# EasyEDA Pro project ProProject_李勇成毕设2_2024-03-25_23-08-12_2024-03-26.epro

# Schematic Schematic1
Create Date: 2024-03-25; Page Name: P1; Project Name: 李勇成毕设_2024-03-25_23-08-12; Schematic Name: Schematic1; Update Date: 2024-03-25; Company: 嘉立创EDA; Page Size: A4; Version: V1.0
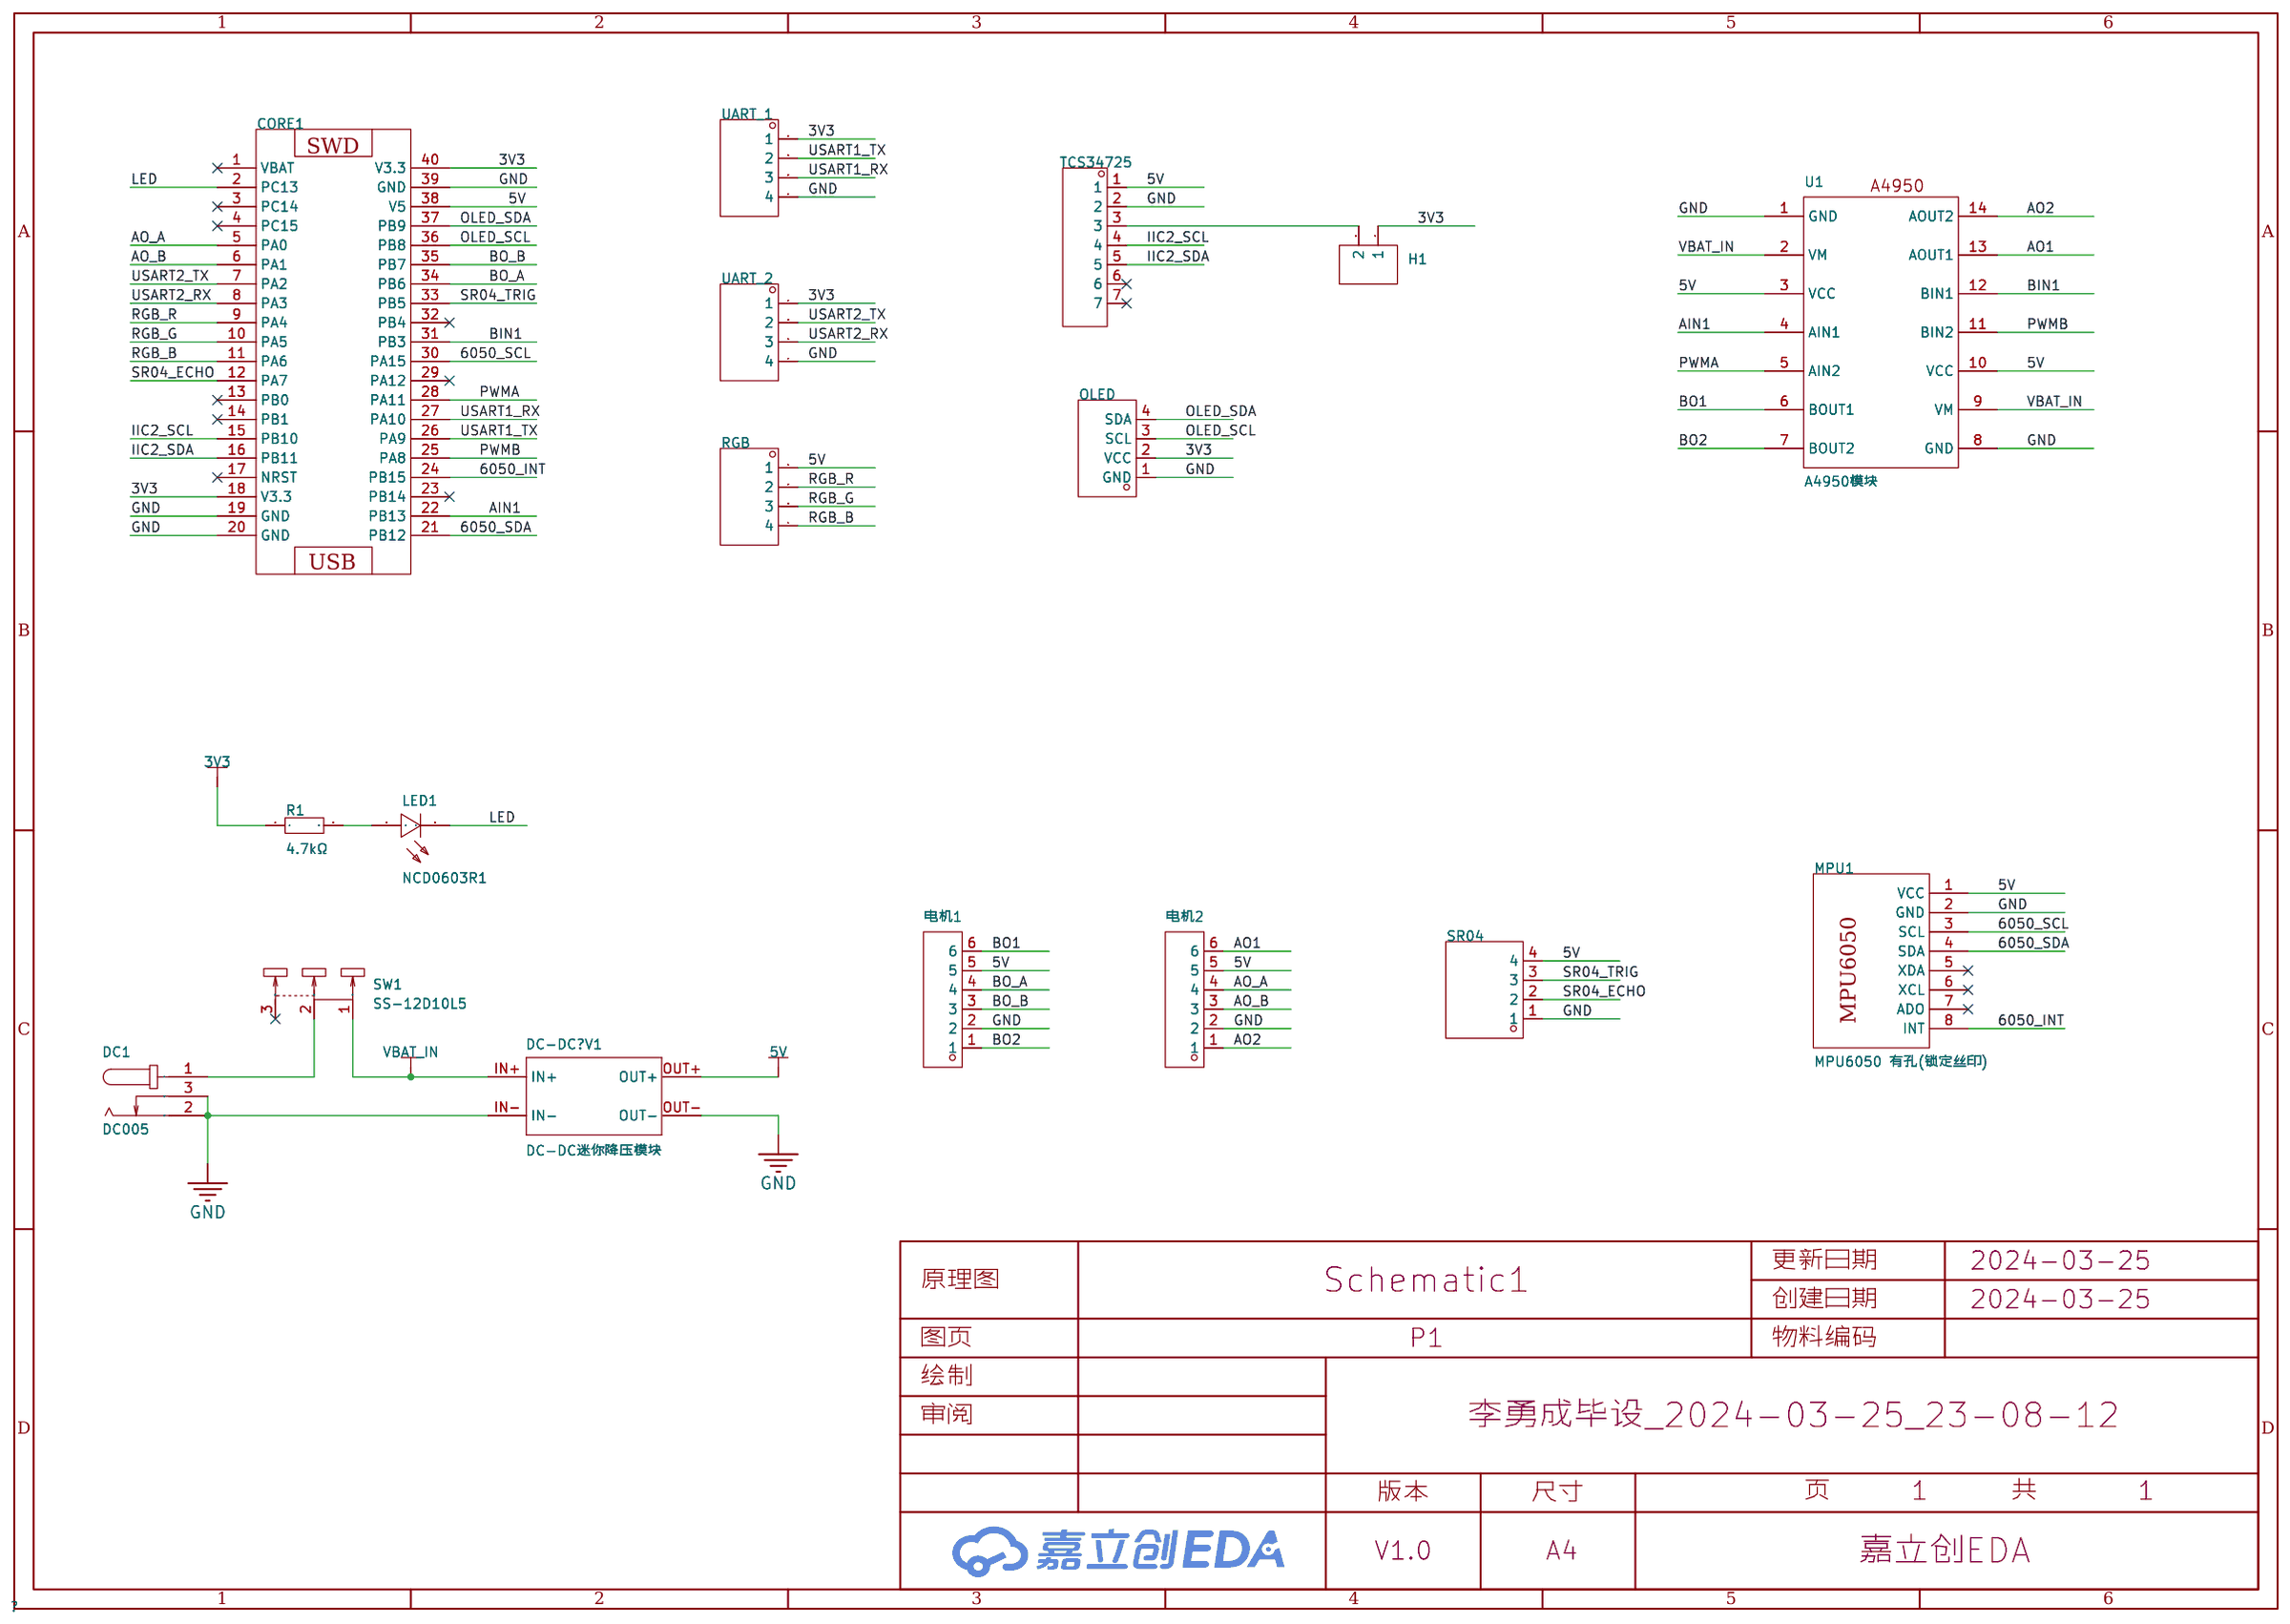
[diagram p0: schematic sheet]

## Parts
CORE1  -  [STM32F103C8T6核心板]
DC1  DC005  [DC-IN-TH_DC005]
DC-DC?V1  DC-DC迷你降压模块  [DC-DC迷你降压模块]
H1  -  [HDR-TH_2P-P2.54-V-F]
LED1  NCD0603R1  [LED0603-RD_RED]
MPU1  MPU6050 有孔(锁定丝印)  [MPU6050-丝印不可移]
OLED  HS96L03W2C03  [OLED-TH_L27.8-W27.2-P2.54_C9900033791]
R1  4.7kΩ  [R0603]
RGB  RGB  [HDR-TH_4P-P2.54-V-M]
SR04  A2541HWV-4P  [HDR-TH_4P-P2.54-V_A2541HWV-4P]
SW1  SS-12D10L5  [SW-TH_SS-12D10L5]
TCS34725  TCS34725  [HDR-TH_7P-P2.54-V-F]
U1  A4950模块  [A4950]
UART_1  UART_1  [HDR-TH_4P-P2.54-V-M]
UART_2  UART_2  [HDR-TH_4P-P2.54-V-M]
电机1  X8821WR-06S-N0SN  [CONN-TH_6P-P2.50_X8821WR-06S-N2SN]
电机2  X8821WR-06S-N0SN  [CONN-TH_6P-P2.50_X8821WR-06S-N2SN]

## Library data of the parts
CORE1 = STM32F103C8T6核心板: tags: STM32; Supplier Part: C8734; Manufacturer: 无; Manufacturer Part: STM32F103C8T6最小系统模块; image: http://image.lceda.cn/szlcsc/C8734.jpg
DC1 = DC005: 连接器类型:DC电源插座;安装方式:弯插;触点内径:2mm;触点外径:6.3mm;额定电流:500mA;额定电压:30V;工作温度范围:-40℃~+55℃;; LCSC Part Name: DC电源插座 内径:2mm 外径:6.3mm; Supplier Part: C431533; Manufacturer: SHOU HAN(首韩); Supplier Footprint: 插件; JLCPCB Part Class: 扩展库; Datasheet: https://atta.szlcsc.com/upload/public/pdf/source/20190925/C431533_4751811035784AC1D38EBC85F7905E99.pdf; Supplier: LCSC; Connector Type: DC电源插座; Mounting Style: 弯插; Inside Contact Diameter: 2mm; Outside Contact Diameter: 6.3mm; Current Rating (Max): 500mA; Voltage Rating (Max): 30V; Operating Temperature Range: -40℃~+55℃
DC-DC?V1 = DC-DC迷你降压模块: _: 3
H1 = HDR-F_2.54_1x2P: Supplier Part: C49661; Supplier Footprint: 插件
LED1 = NCD0603R1_C84263: 灯头类型:-;发光颜色:红色;正向电压(VF):1.6V~2.6V;功率:65mW;正向电流:20mA;主波长:615nm~630nm;二极管配置:独立二极管;透镜颜色:无色透明透镜;色温:-;发光强度:80mcd~220mcd;发光角度:130°;载带方式:-;工作温度:-30℃~+85℃;; Supplier Part: C84263; Manufacturer: 国星光电; Supplier Footprint: 0603; JLCPCB Part Class: 扩展库; Datasheet: https://atta.szlcsc.com/upload/public/pdf/source/20200820/C84263_DABC6A75E58F576973B407FDBA283D60.pdf; Supplier: LCSC; Emitted Color: 红色; Forward Voltage (VF): 1.6V~2.6V; Power Dissipation: 65mW; Forward Current: 20mA; Dominant Wavelength: 615nm~630nm; Diode Configuration: 独立二极管; Lens Color: 无色透明透镜; Luminous Intensity: 80mcd~220mcd; Viewing Angle: 130°; Operating Temperature: -30℃~+85℃
MPU1 = MPU6050 有孔(锁定丝印)
OLED = HS96L03W2C03: 主控芯片:SSD1315;接口类型:I2C;尺寸(inch):0.96;像素分辨率:128x64;; LCSC Part Name: 0.96寸OLED显示屏窄白光IIC; Supplier Part: C5248080; Manufacturer: HS(汉昇); JLCPCB Part Class: Extended Part; Datasheet: https://atta.szlcsc.com/upload/public/pdf/source/20230627/763D01F79A90007632F098068C7C8AD9.pdf; Supplier: LCSC; Main Control Chip: SSD1315; Interface Type: I2C; Size: 0.96; Pixel Resolution: 128x64; Operating Temperature: -40℃~+70℃
R1 = 0603WAF1002T5E: 电阻类型:厚膜电阻;阻值:10kΩ;精度:±1%;功率:100mW;最大工作电压:75V;温度系数:±100ppm/℃;; LCSC Part Name: 厚膜电阻 10kΩ ±1% 100mW; Supplier Part: C25804; Manufacturer: UNI-ROYAL(厚声); Supplier Footprint: 0603; JLCPCB Part Class: Basic Part; Datasheet: https://atta.szlcsc.com/upload/public/pdf/source/20200306/C422600_1E6D84923E4A46A82E41ADD87F860B5C.pdf; Supplier: LCSC; Type: 厚膜电阻; Tolerance: ±1%; Power(Watts): 100mW; Overload Voltage (Max): 75V; Temperature Coefficient: ±100ppm/℃; Operating Temperature Range: -55℃~+155℃
RGB UART_1 UART_2 = B-2100S04P-A110: 插针结构:1x4P;间距:2.54mm;行距:-;圆针/方针:-;安装类型:直插;排数:单排;总PIN位数:4P;额定电流:-;额定电压:-;配合针长度:6mm;塑高:2.54mm;端接针长度:3mm;触头材质:黄铜;触头镀层:-;工作温度范围:-40℃~+105℃;颜色:黑色;; LCSC Part Name: 间距:2.54mm 1x4P 直插; Supplier Part: C124378; Manufacturer: Ckmtw(灿科盟); Supplier Footprint: 插件,P=2.54mm; JLCPCB Part Class: 扩展库; Datasheet: https://atta.szlcsc.com/upload/public/pdf/source/20170821/C124381_1503303309126901535.pdf; Supplier: LCSC; Pin Structure: 1x4P; Pitch: 2.54mm; Mounting Type: 直插; Number of Rows: 单排; Number of Pins: 4P; Length of Mating Pin: 6mm; Insulation Height: 2.54mm; Length of End Connection Pin: 3mm; Contact Material: 黄铜; Operating Temperature Range: -40℃~+105℃; Color: 黑色
SR04 = A2541HWV-4P: 插孔结构:1x4P;间距:2.54mm;行距:-;安装类型:直插;排数:单排;总孔位数:4P;塑高:-;触头材质:黄铜;触头镀层:金;; LCSC Part Name: 间距:2.54mm 1x4P 直插; Supplier Part: C225501; Manufacturer: CJT(长江连接器); Supplier Footprint: 插件,P=2.54mm; JLCPCB Part Class: 扩展库; Datasheet: https://atta.szlcsc.com/upload/public/pdf/source/20180724/C239359_48B1BC0CA1B4E4396A63955AAFD15564.pdf; Supplier: LCSC; Holes Structure: 1x4P; Pitch: 2.54mm; Mounting Type: 直插; Number of Rows: 单排; Number of Holes: 4P; Contact Material: 黄铜; Contact Plating: 金
SW1 = SS-12D10L5: 电路结构:单刀双掷;安装方式:直插;开关颜色:黑色;额定电流(DC):3A;额定电压(DC):125V;额定电流(AC):3A;额定电压(AC):125V;机械寿命:1万次;; LCSC Part Name: 柄长5mm 直插双档 滑动开关; Supplier Part: C319012; Manufacturer: XKB Connectivity(中国星坤); Supplier Footprint: 插件; JLCPCB Part Class: 扩展库; Datasheet: https://atta.szlcsc.com/upload/public/pdf/source/20211009/D6412F37AABE6F9459A6EE7FA4DAEADB.pdf; Supplier: LCSC; Circuit: 单刀双掷; Actuator Style: 矩形柱状; Pin Style: PC引脚; Switch Length: 13mm; Switch Width: 6.8mm; Switch Height: 6.4mm; Mounting Style: 直插; Actuator Color: 黑色; Current Rating (DC): 3A; Voltage Rating (DC): 125V; Current Rating (AC): 3A; Voltage Rating (AC): 125V; Mechanical Life: 1万次; Operating Temperature: -40℃~+85℃
TCS34725 = HDR-F_2.54_1x7P: Supplier Part: C124418; Supplier Footprint: 插件
U1 = A4950模块
电机1 电机2 = X8821WR-06S-N0SN: 插针结构:1x6P;间距:2.5mm;安装方式:弯插;参考系列:XH;总PIN数:6P;排数:1;每排PIN数:6;行距:-;额定电流:3A;触头材质:黄铜;触头镀层:锡;工作温度范围:-;; LCSC Part Name: 1x6P 间距:2.5mm 弯插 系列:XH; Supplier Part: C388743; Manufacturer: XKB Connection(中国星坤); Supplier Footprint: 弯插,P=2.54mm; JLCPCB Part Class: 扩展库; Datasheet: https://atta.szlcsc.com/upload/public/pdf/source/20211009/984C14C41D2B1156BCF8EEF5D296E395.pdf; Supplier: LCSC; Pins Structure: 1x6P; Pitch: 2.5mm; Mounting Style: 弯插; Reference Series: XH; Number of Pins: 6P; Number of Rows: 1; Number of PINs Per Row: 6; Current Rating (Max): 3A; Contact Material: 黄铜; Contact Plating: 锡

## Nets
3V3: CORE1.18(V3.3) CORE1.40(V3.3) H1.1 OLED.2(VCC) R1.1 UART_1.1 UART_2.1
5V: CORE1.38(V5) DC-DC?V1.OUT+ MPU1.1(VCC) RGB.1 SR04.4 TCS34725.1 U1.3(VCC) U1.10(VCC) 电机1.5 电机2.5
GND: CORE1.19(GND) CORE1.20(GND) CORE1.39(GND) DC1.2 DC1.3 DC-DC?V1.IN- DC-DC?V1.OUT- MPU1.2(GND) OLED.1(GND) SR04.1 TCS34725.2 U1.1(GND) U1.8(GND) UART_1.4 UART_2.4 电机1.2 电机2.2
VBAT_IN: DC-DC?V1.IN+ SW1.1 U1.2(VM) U1.9(VM)
6050_INT: CORE1.24(PB15) MPU1.8(INT)
6050_SCL: CORE1.30(PA15) MPU1.3(SCL)
6050_SDA: CORE1.21(PB12) MPU1.4(SDA)
AIN1: CORE1.22(PB13) U1.4(AIN1)
AO1: U1.13(AOUT1) 电机2.6
AO2: U1.14(AOUT2) 电机2.1
AO_A: CORE1.5(PA0) 电机2.4
AO_B: CORE1.6(PA1) 电机2.3
BIN1: CORE1.31(PB3) U1.12(BIN1)
BO1: U1.6(BOUT1) 电机1.6
BO2: U1.7(BOUT2) 电机1.1
BO_A: CORE1.34(PB6) 电机1.4
BO_B: CORE1.35(PB7) 电机1.3
IIC2_SCL: CORE1.15(PB10) TCS34725.4
IIC2_SDA: CORE1.16(PB11) TCS34725.5
LED: CORE1.2(PC13) LED1.1(K)
OLED_SCL: CORE1.36(PB8) OLED.3(SCL)
OLED_SDA: CORE1.37(PB9) OLED.4(SDA)
PWMA: CORE1.28(PA11) U1.5(AIN2)
PWMB: CORE1.25(PA8) U1.11(BIN2)
RGB_B: CORE1.11(PA6) RGB.4
RGB_G: CORE1.10(PA5) RGB.3
RGB_R: CORE1.9(PA4) RGB.2
SR04_ECHO: CORE1.12(PA7) SR04.2
SR04_TRIG: CORE1.33(PB5) SR04.3
USART1_RX: CORE1.27(PA10) UART_1.3
USART1_TX: CORE1.26(PA9) UART_1.2
USART2_RX: CORE1.8(PA3) UART_2.3
USART2_TX: CORE1.7(PA2) UART_2.2
$1N1070: DC1.1 SW1.2
$1N1648: H1.2 TCS34725.3
$1N3009: LED1.2(A) R1.2

Not connected (* = marked no-connect by the designer): CORE1 1(VBAT)* 3(PC14)* 4(PC15)* 13(PB0)* 14(PB1)* 17(NRST)* 23(PB14)* 29(PA12)* 32(PB4)*; MPU1 5(XDA)* 6(XCL)* 7(ADO)*; SW1 3*; TCS34725 6* 7*

# Schematic Schematic2
Create Date: 2024-03-26; Page Name: P1; Project Name: 李勇成毕设_2024-03-25_23-08-12; Schematic Name: Schematic2; Update Date: 2024-03-26; Company: 嘉立创EDA; Page Size: A4; Version: V1.0
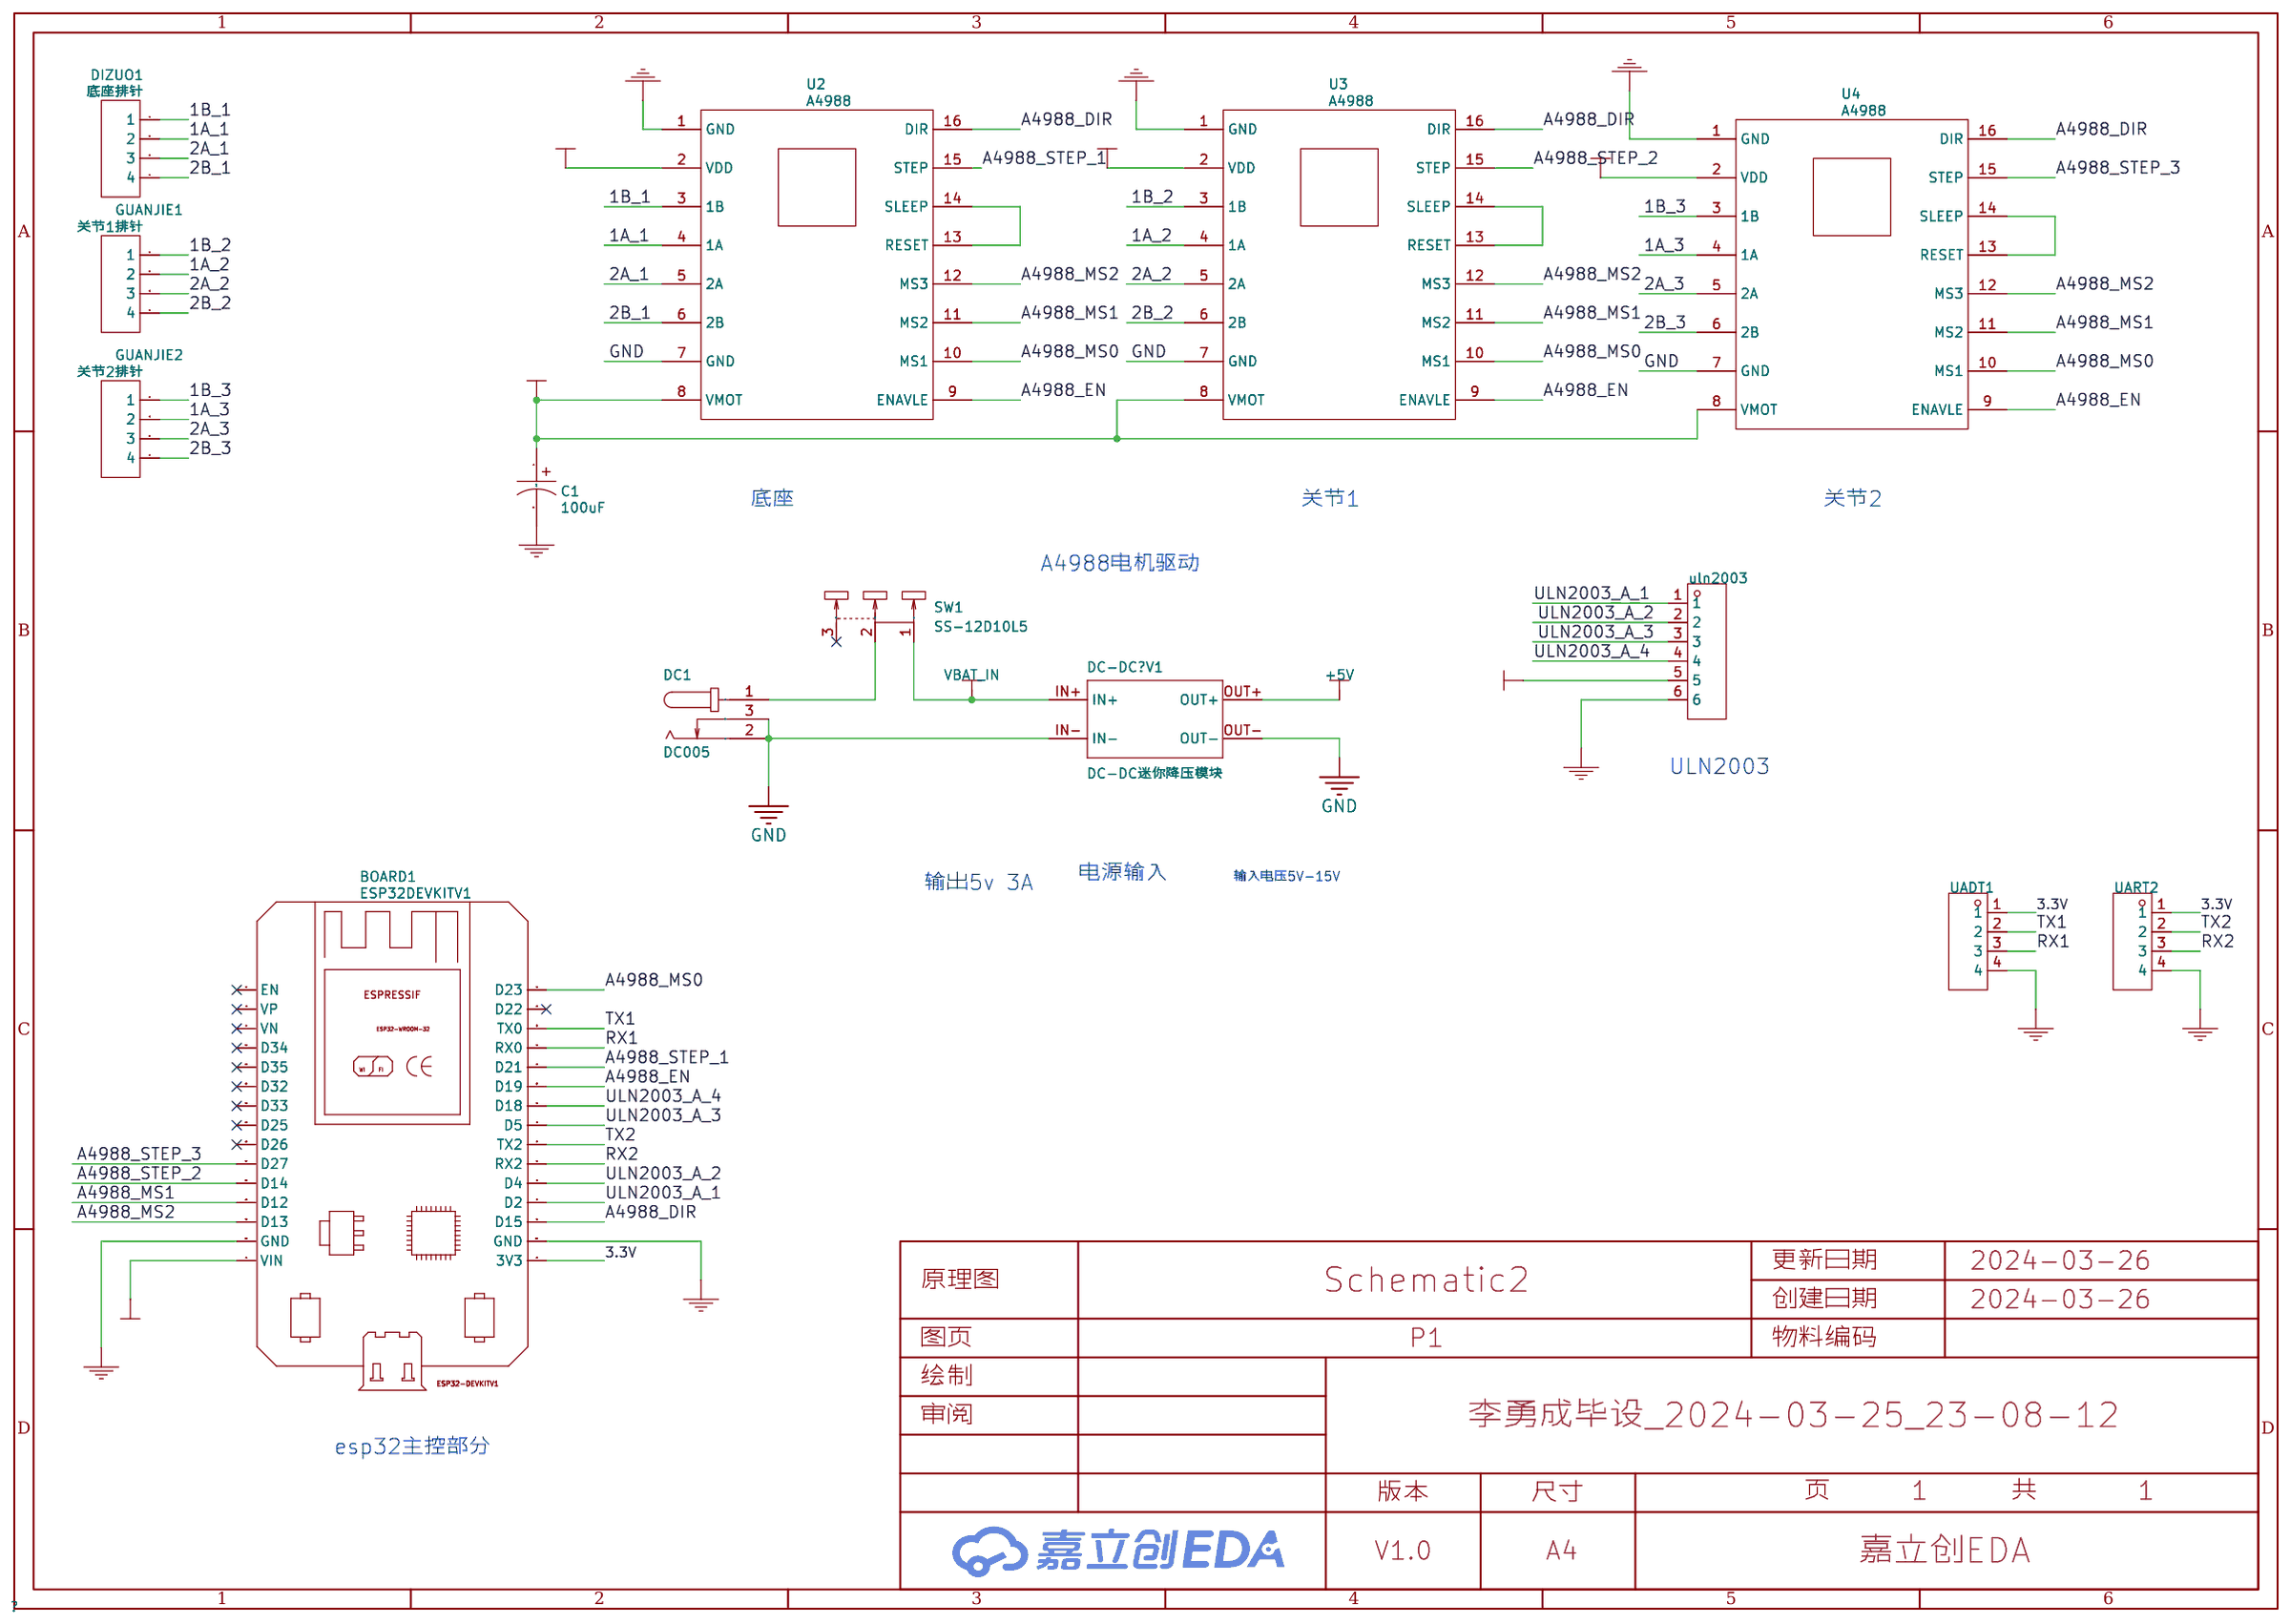
[diagram p1: schematic sheet]

## Parts
BOARD1  ESP32DEVKITV1  [footprint_15ac]
C1  100uF  [footprint_4e1d]
DC1  DC005  [DC-IN-TH_DC005]
DC-DC?V1  DC-DC迷你降压模块  [DC-DC迷你降压模块]
DIZUO1  底座排针  [footprint_92c2]
GUANJIE1  关节1排针  [footprint_92c2]
GUANJIE2  关节2排针  [footprint_92c2]
SW1  SS-12D10L5  [SW-TH_SS-12D10L5]
U2  A4988  [footprint_3c00]
U3  A4988  [footprint_3c00]
U4  A4988  [footprint_3c00]
UADT1  -  [HDR-TH_4P-P2.54-V-M]
UART2  -  [HDR-TH_4P-P2.54-V-M]
uln2003  -  [HDR-TH_6P-P2.54-V-F]

## Library data of the parts
BOARD1 = ESP32DEVKITV1
C1 = 100uF
DC1 = DC005: 连接器类型:DC电源插座;安装方式:弯插;触点内径:2mm;触点外径:6.3mm;额定电流:500mA;额定电压:30V;工作温度范围:-40℃~+55℃;; LCSC Part Name: DC电源插座 内径:2mm 外径:6.3mm; Supplier Part: C431533; Manufacturer: SHOU HAN(首韩); Supplier Footprint: 插件; JLCPCB Part Class: 扩展库; Datasheet: https://atta.szlcsc.com/upload/public/pdf/source/20190925/C431533_4751811035784AC1D38EBC85F7905E99.pdf; Supplier: LCSC; Connector Type: DC电源插座; Mounting Style: 弯插; Inside Contact Diameter: 2mm; Outside Contact Diameter: 6.3mm; Current Rating (Max): 500mA; Voltage Rating (Max): 30V; Operating Temperature Range: -40℃~+55℃
DC-DC?V1 = DC-DC迷你降压模块: _: 3
DIZUO1 = 底座排针: Supplier Part: C225501; Supplier: LCSC
GUANJIE1 = 关节1排针: Supplier Part: C225501; Supplier: LCSC
GUANJIE2 = 关节2排针: Supplier Part: C225501; Supplier: LCSC
SW1 = SS-12D10L5: 电路结构:单刀双掷;安装方式:直插;开关颜色:黑色;额定电流(DC):3A;额定电压(DC):125V;额定电流(AC):3A;额定电压(AC):125V;机械寿命:1万次;; LCSC Part Name: 柄长5mm 直插双档 滑动开关; Supplier Part: C319012; Manufacturer: XKB Connectivity(中国星坤); Supplier Footprint: 插件; JLCPCB Part Class: 扩展库; Datasheet: https://atta.szlcsc.com/upload/public/pdf/source/20211009/D6412F37AABE6F9459A6EE7FA4DAEADB.pdf; Supplier: LCSC; Circuit: 单刀双掷; Actuator Style: 矩形柱状; Pin Style: PC引脚; Switch Length: 13mm; Switch Width: 6.8mm; Switch Height: 6.4mm; Mounting Style: 直插; Actuator Color: 黑色; Current Rating (DC): 3A; Voltage Rating (DC): 125V; Current Rating (AC): 3A; Voltage Rating (AC): 125V; Mechanical Life: 1万次; Operating Temperature: -40℃~+85℃
U2-U4 = A4988
UADT1 UART2 = HDR-M_2.54_1x4P: Supplier Part: C492403; Supplier Footprint: 插件
uln2003 = HDR-F_2.54_1x6P: Supplier Part: C40877; Supplier Footprint: 插件

## Nets
3.3V: BOARD1.3V3 UADT1.1 UART2.1
+5V: BOARD1.VIN DC-DC?V1.OUT+ U2.2(VDD) U3.2(VDD) U4.2(VDD) uln2003.5
GND: BOARD1.GND BOARD1.GND@1(GND) C1.2 DC1.2 DC1.3 DC-DC?V1.IN- DC-DC?V1.OUT- U2.1(GND) U2.7(GND) U3.1(GND) U3.7(GND) U4.1(GND) U4.7(GND) UADT1.4 UART2.4 uln2003.6
VBAT_IN: C1.1 DC-DC?V1.IN+ SW1.1 U2.8(VMOT) U3.8(VMOT) U4.8(VMOT)
1A_1: DIZUO1.2 U2.4(1A)
1A_2: GUANJIE1.2 U3.4(1A)
1A_3: GUANJIE2.2 U4.4(1A)
1B_1: DIZUO1.1 U2.3(1B)
1B_2: GUANJIE1.1 U3.3(1B)
1B_3: GUANJIE2.1 U4.3(1B)
2A_1: DIZUO1.3 U2.5(2A)
2A_2: GUANJIE1.3 U3.5(2A)
2A_3: GUANJIE2.3 U4.5(2A)
2B_1: DIZUO1.4 U2.6(2B)
2B_2: GUANJIE1.4 U3.6(2B)
2B_3: GUANJIE2.4 U4.6(2B)
A4988_DIR: BOARD1.D15 U2.16(DIR) U3.16(DIR) U4.16(DIR)
A4988_EN: BOARD1.D19 U2.9(ENAVLE) U3.9(ENAVLE) U4.9(ENAVLE)
A4988_MS0: BOARD1.D23 U2.10(MS1) U3.10(MS1) U4.10(MS1)
A4988_MS1: BOARD1.D12 U2.11(MS2) U3.11(MS2) U4.11(MS2)
A4988_MS2: BOARD1.D13 U2.12(MS3) U3.12(MS3) U4.12(MS3)
A4988_STEP_1: BOARD1.D21 U2.15(STEP)
A4988_STEP_2: BOARD1.D14 U3.15(STEP)
A4988_STEP_3: BOARD1.D27 U4.15(STEP)
RX1: BOARD1.RX0 UADT1.3
RX2: BOARD1.RX2 UART2.3
TX1: BOARD1.TX0 UADT1.2
TX2: BOARD1.TX2 UART2.2
ULN2003_A_1: BOARD1.D2 uln2003.1
ULN2003_A_2: BOARD1.D4 uln2003.2
ULN2003_A_3: BOARD1.D5 uln2003.3
ULN2003_A_4: BOARD1.D18 uln2003.4
$1N825: U2.13(RESET) U2.14(SLEEP)
$1N826: U3.13(RESET) U3.14(SLEEP)
$1N849: U4.13(RESET) U4.14(SLEEP)
$1N1306: DC1.1 SW1.2

Not connected (* = marked no-connect by the designer): BOARD1 D22* D25* D26* D32* D33* D34* D35* EN* VN* VP*; SW1 3*

## Notes on the sheet
- 底座
- 关节1
- 关节2
- A4988电机驱动
- ULN2003
- 电源输入
- 输入电压5V-15V
- 输出5v 3A
- esp32主控部分

# Board PCB3
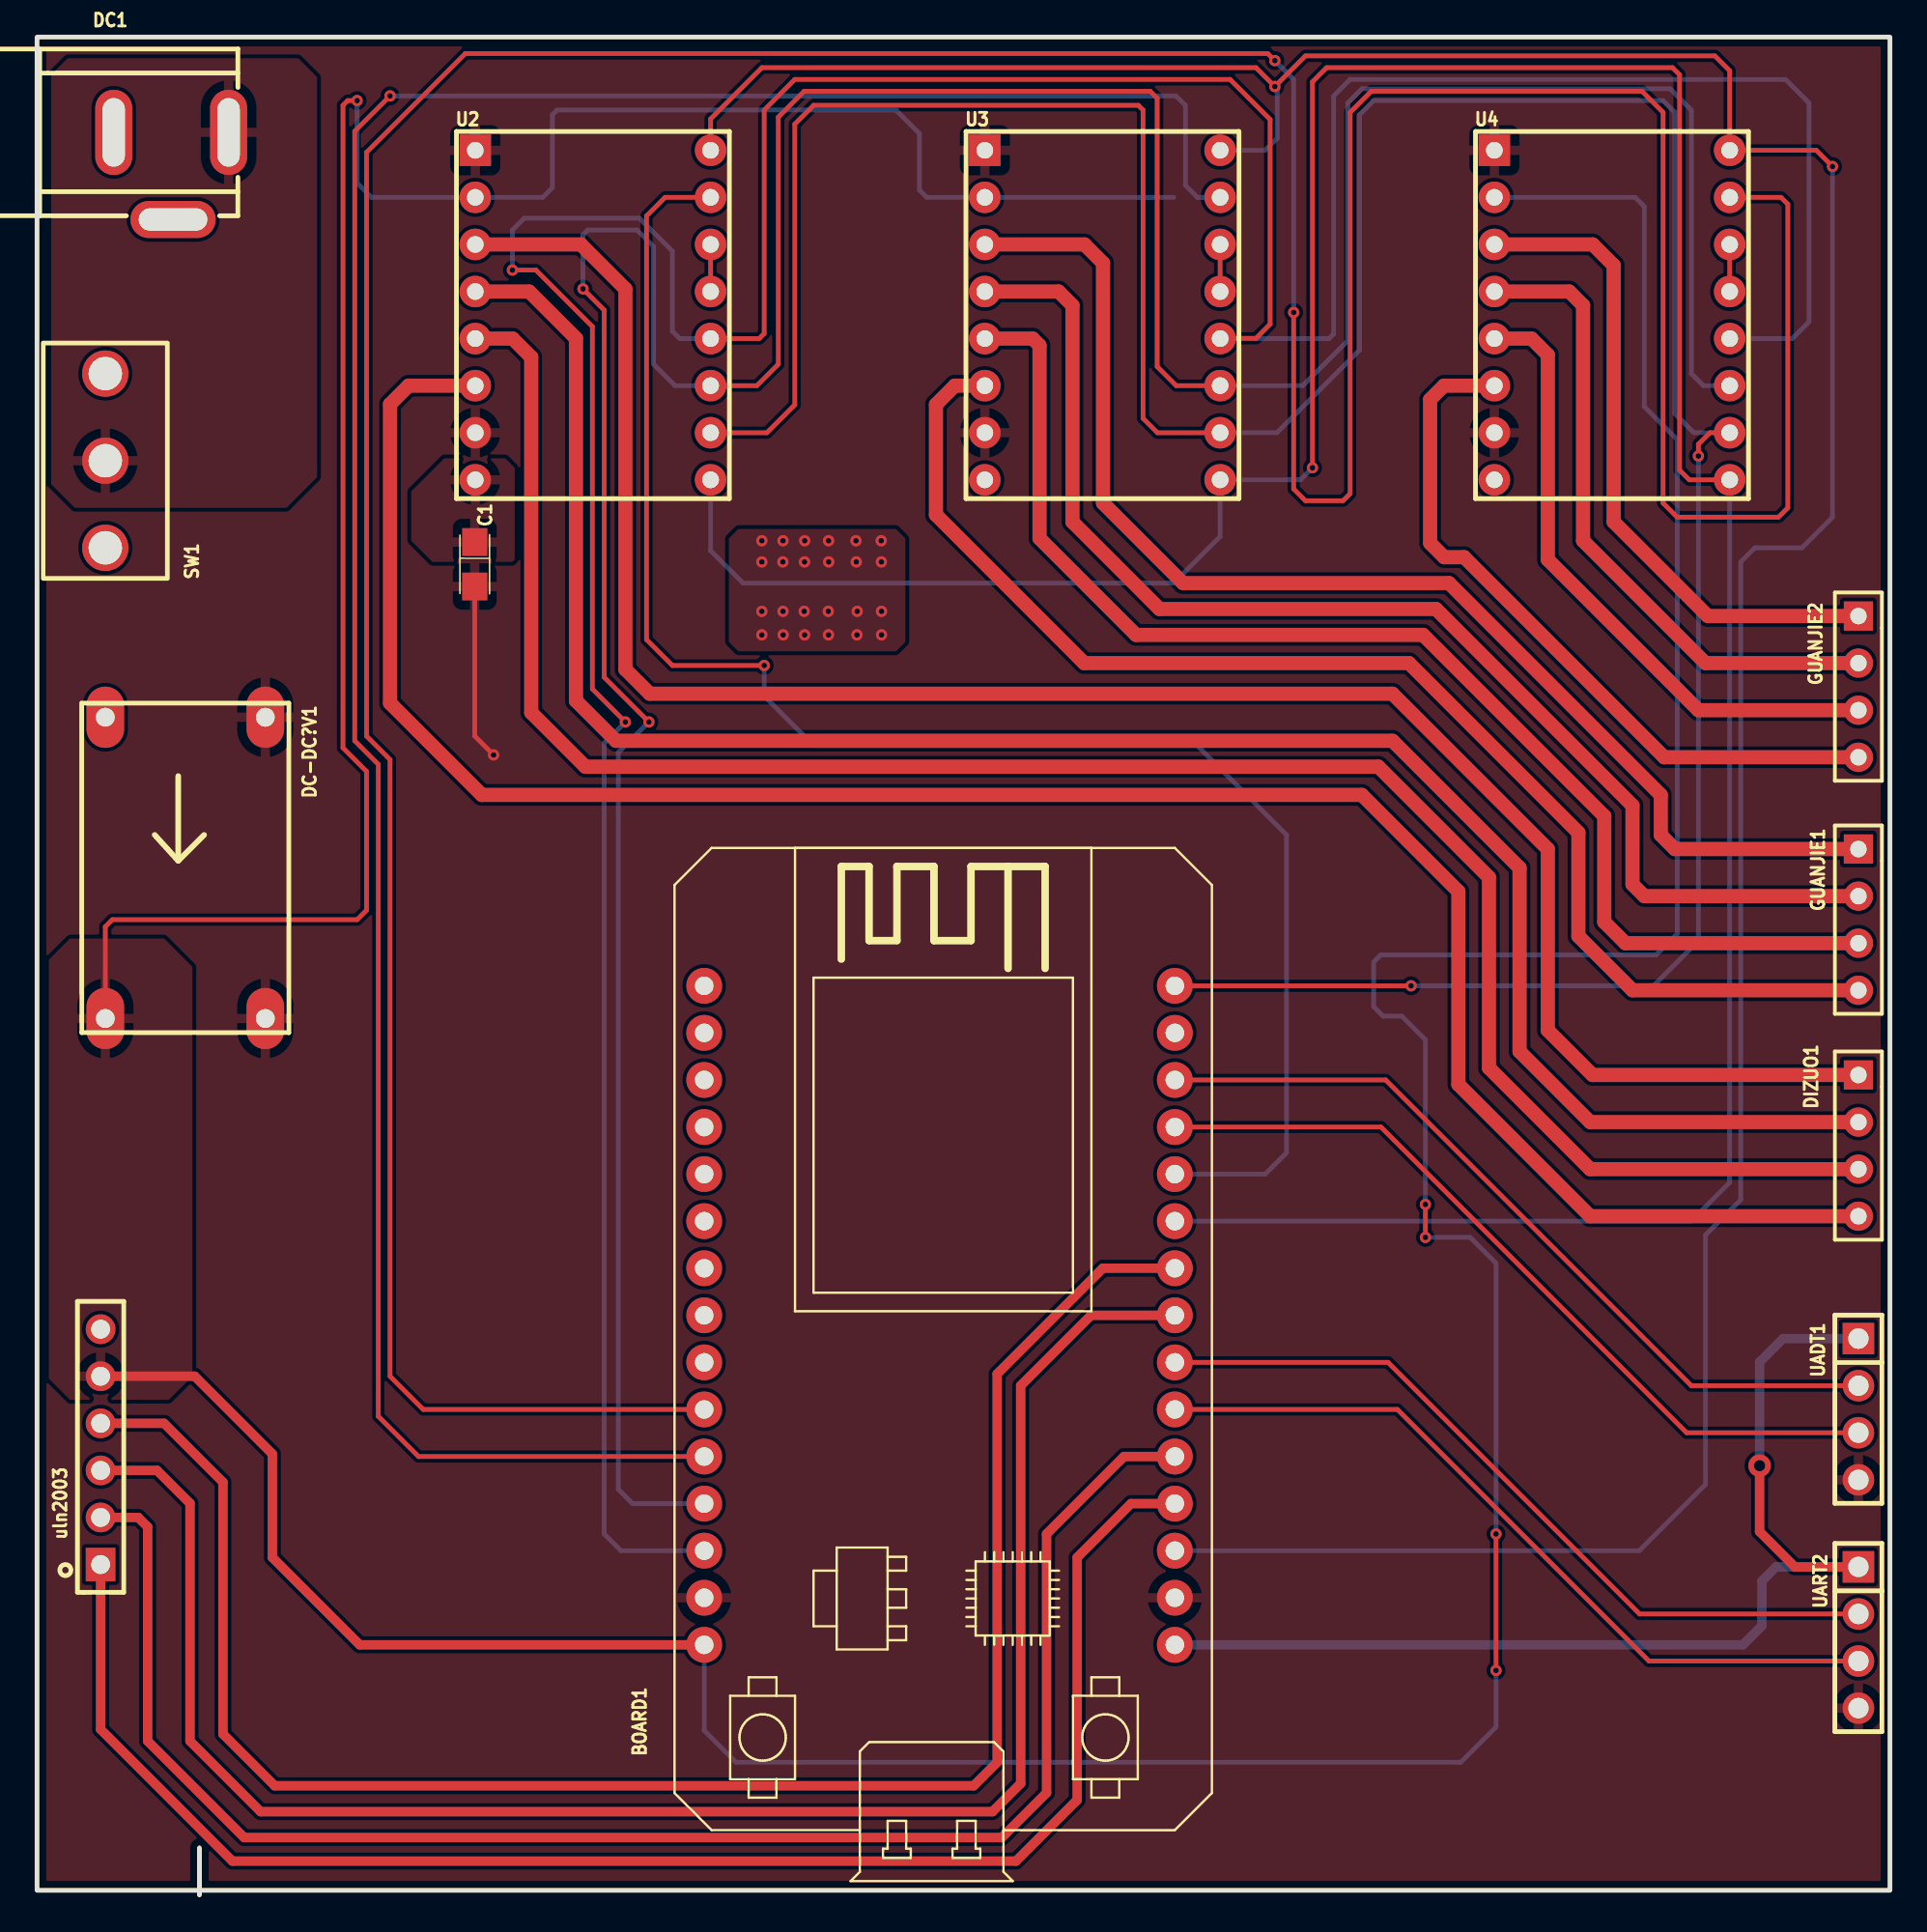
[diagram p2: board, top side]
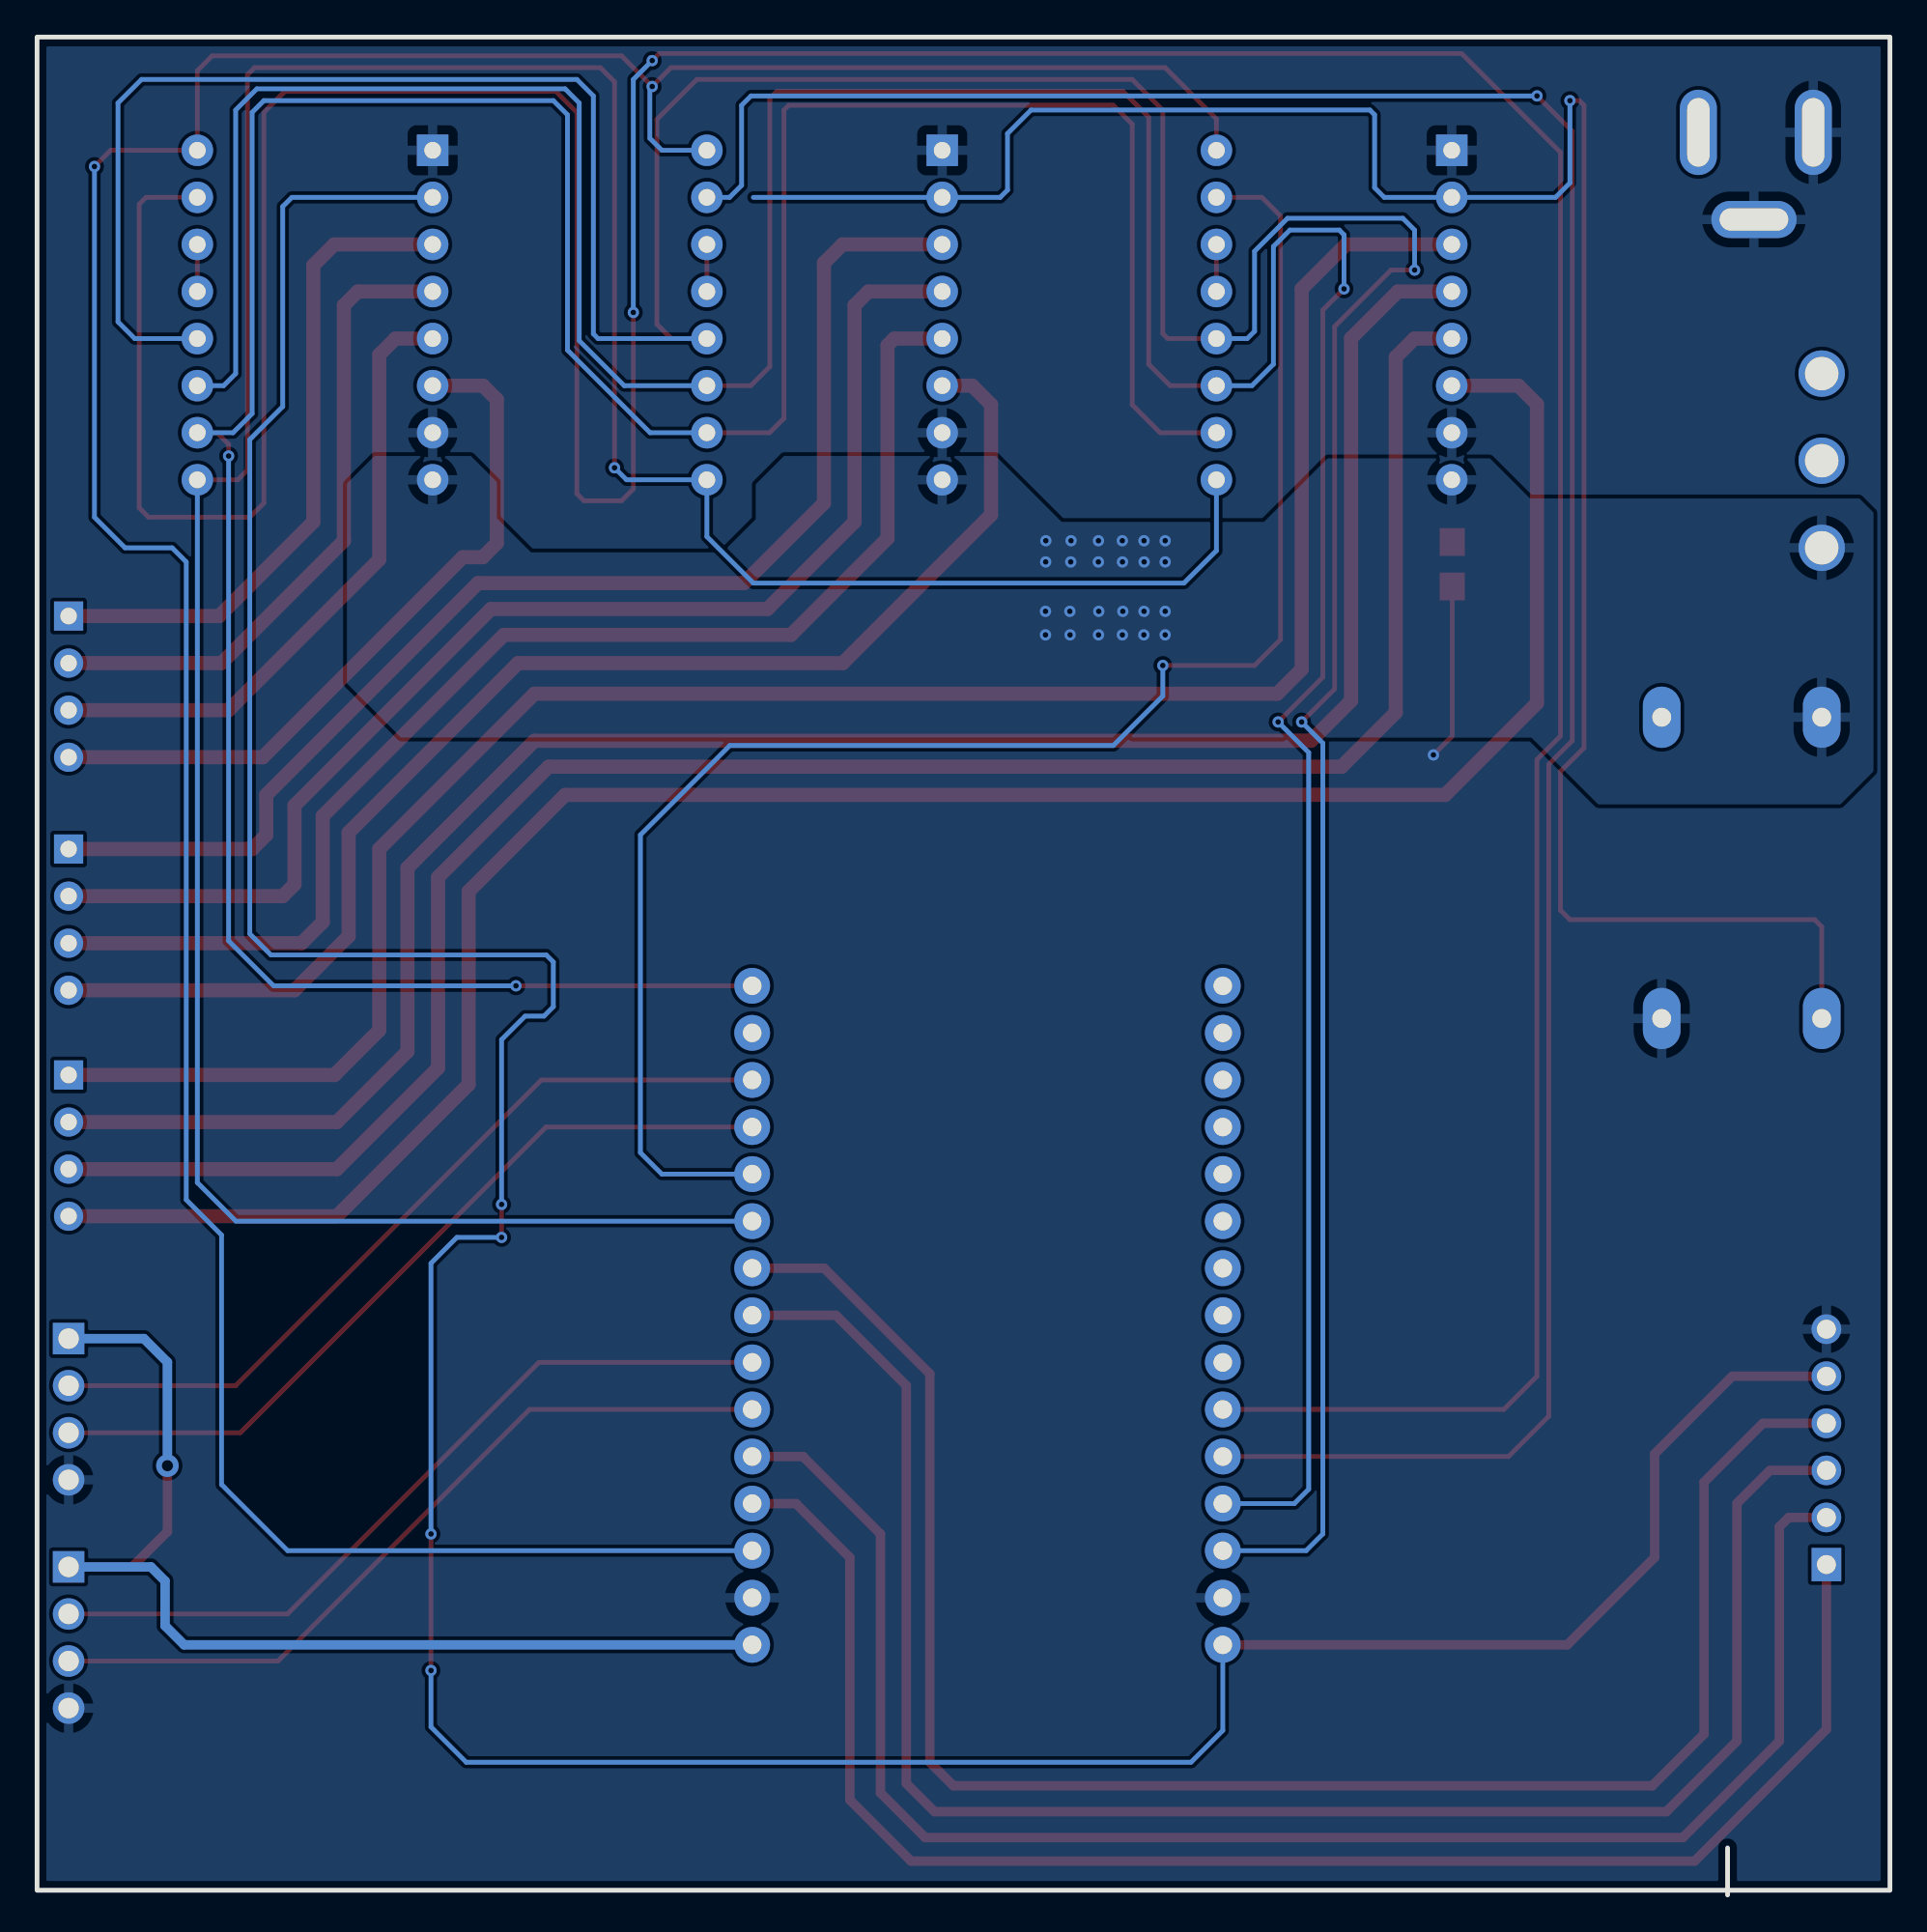
[diagram p3: board, bottom side, seen from below]

Outline 100 x 100.25 mm; copper layers: Top Layer, Bottom Layer. Coordinates in mm from the lower left corner of the outline.
Outline path: rectangle 0,100.25 100,0.25 ; 8.76,0 8.76,2.54
Stack: Top Layer 0.035mm / Dielectric1 1.51mm FR4 er 4.5 / Bottom Layer 0.035mm

## Design rules (mm)
template: 自定义配置
spacing copperThickness1oz (default): track to track 0.102, other pairs 0.152 to 0.3
spacing copperThickness2oz: track to track 0.203, other pairs 0.152 to 0.3
track width copperThickness1oz (default): min 0.127, default 0.254, max 2.54
track width copperThickness2oz: min 0.203, default 0.254, max 2.54
differential pair differentialPair (default): width min 0.127, default 0.254, max 2.54; gap min 0.152, default 0.152
via viaSize (default): diameter min 0.5, default 0.61, max 10; hole min 0.3, default 0.305, max 6.299
pour e1060 uses copperRegion

## Placement (name value [footprint] x y rotation side)
BOARD1  ESP32DEVKITV1  [footprint_15ac]  -1165.95 1232.58 90 top
C1  100uF  [footprint_4e1d]  23.62 71.8 270 top
DC1  DC005  [DC-IN-TH_DC005]  7.24 92.76 0 top
DC-DC?V1  -  [DC-DC迷你降压模块]  2.41 63.55 270 top
DIZUO1  底座排针  [footprint_92c2]  98.3 40.43 270 top
GUANJIE1  关节1排针  [footprint_92c2]  98.3 52.63 270 top
GUANJIE2  关节2排针  [footprint_92c2]  98.3 65.2 270 top
SW1  SS-12D10L5  [SW-TH_SS-12D10L5]  3.68 77.39 90 top
U2  A4988  [footprint_3c00]  30 85.25 0 top
U3  A4988  [footprint_3c00]  57.5 85.25 0 top
U4  A4988  [footprint_3c00]  85 85.25 0 top
UADT1  -  [HDR-TH_4P-P2.54-V-M]  98.3 26.21 270 top
UART2  -  [HDR-TH_4P-P2.54-V-M]  98.3 13.89 270 top
uln2003  -  [HDR-TH_6P-P2.54-V-F]  3.43 24.18 90 top

## Footprints (pads in the part's own frame, mm; a bottom-side part is the same pattern mirrored in y, then rotated)
DC-DC迷你降压模块
  oval 3.302x2.032 hole 1.016: IN+(0,1.27) IN-(0,9.906) OUT+(16.256,1.27) OUT-(16.256,9.906)
DC-IN-TH_DC005
  oval 2x4.6 hole 1.2x3.7: 1(3.1,2.35) 2(-3.1,2.35)
  oval 4.6x2 hole 3.7x1.2: 3(0.1,-2.35)
footprint_3c00
  rect 1.7x1.7 hole 0.9: 1(-6.35,8.89)
  round 1.7 hole 0.9: 2(-6.35,6.35) 3(-6.35,3.81) 4(-6.35,1.27) 5(-6.35,-1.27) 6(-6.35,-3.81) 7(-6.35,-6.35) 8(-6.35,-8.89) 9(6.35,-8.89) 10(6.35,-6.35) 11(6.35,-3.81) 12(6.35,-1.27) 13(6.35,1.27) 14(6.35,3.81) 15(6.35,6.35) 16(6.35,8.89)
footprint_4e1d
  rect 1.5x1.359 smd: 1(-1.2,0) 2(1.2,0)
footprint_15ac
  round 1.931 hole 1x1: 3V3(-1219.086,-1227.36) D2(-1211.466,-1227.36) D4(-1208.927,-1227.36) D5(-1201.306,-1227.36) D12(-1211.466,-1201.96) D13(-1214.006,-1201.96) D14(-1208.927,-1201.96) D15(-1214.006,-1227.36) D18(-1198.766,-1227.36) D19(-1196.226,-1227.36) D21(-1193.687,-1227.36) D22(-1186.066,-1227.36) D23(-1183.526,-1227.36) D25(-1201.306,-1201.96) D26(-1203.847,-1201.96) D27(-1206.387,-1201.96) D32(-1196.226,-1201.96) D33(-1198.766,-1201.96) D34(-1191.147,-1201.96) D35(-1193.687,-1201.96) EN(-1183.526,-1201.96) GND(-1216.546,-1201.96) GND@1(-1216.546,-1227.36) RX0(-1191.147,-1227.36) RX2(-1206.387,-1227.36) TX0(-1188.607,-1227.36) TX2(-1203.847,-1227.36) VIN(-1219.086,-1201.96) VN(-1188.607,-1201.96) VP(-1186.066,-1201.96)
footprint_92c2
  rect 1.575x1.575 hole 0.889: 1(-3.81,0)
  round 1.575 hole 0.889: 2(-1.27,0) 3(1.27,0) 4(3.81,0)
HDR-TH_4P-P2.54-V-M
  rect 1.7x1.7 hole 1.1: 1(-3.81,0)
  round 1.7 hole 1.1: 2(-1.27,0) 3(1.27,0) 4(3.81,0)
HDR-TH_6P-P2.54-V-F
  rect 1.8x1.6 hole 1.02: 1(-6.35,0)
  round 1.6 hole 1.02: 2(-3.81,0) 3(-1.27,0) 4(1.27,0) 5(3.81,0) 6(6.35,0)
SW-TH_SS-12D10L5
  round 2.5 hole 1.8: 1(-4.7,0) 2(0,0) 3(4.7,0)

## Nets
As in the schematic.

Pads without a net: BOARD1 D22 D25 D26 D32 D33 D34 D35 EN VN VP; SW1 3

## Via types
v1: diameter 0.61, hole 0.305, Top Layer to Bottom Layer, 43 vias
v2: diameter 1.219, hole 0.61, Top Layer to Bottom Layer, 1 via

## Routing (per net, layer and track width the routed paths; a pad name or vN(x,y) marks a point on that pad's centre or on a via; arc(x,y) is an arc through that point)
3.3V: length 61.2
  Top Layer w0.508: UART2.1 94.87,17.7 92.96,19.61 v2(92.96,23.16)
  Bottom Layer w0.508: UART2.1 93.85,17.7 93.09,16.94 93.09,14.53 92.06,13.5 BOARD1.3V3 ; v2(92.96,23.16) 92.96,28.75 94.23,30.02 UADT1.1
+5V: length 323.1
  Top Layer w0.254: v1(17.27,96.82) 16.76,96.82 16.51,96.57 16.51,61.9 17.78,60.63 17.78,53.13 17.27,52.63 4.06,52.63 3.68,52.25 DC-DC?V1.OUT+ ; v1(78.74,12.11) v1(78.74,19.48) ; v1(74.93,35.48) v1(74.93,37.26)
  Top Layer w0.508: 3.43,27.99 8.51,27.99 12.7,23.8 12.7,18.21 17.41,13.5 BOARD1.VIN
  Bottom Layer w0.254: v1(74.93,37.26) 74.93,46.15 73.66,47.42 72.64,47.42 72.14,47.93 72.14,50.34 72.52,50.72 87.38,50.72 88.52,51.86 88.52,78.53 86.74,80.31 86.74,91.11 86.25,91.6 U4.2 ; BOARD1.VIN 36.01,8.87 37.72,7.16 76.84,7.16 78.74,9.06 v1(78.74,12.11) ; 61.34,91.6 U3.2 48.02,91.6 47.62,92 47.62,95.04 46.35,96.31 28.07,96.31 27.81,96.06 27.81,92.12 27.29,91.6 U2.2 18.05,91.6 17.27,92.38 v1(17.27,96.82) ; v1(78.74,19.48) 78.74,34.08 77.34,35.48 v1(74.93,35.48)
GND: length 9.5
  Top Layer w0.254: C1.2 23.62,62.53 v1(24.64,61.52)
VBAT_IN:
  vias: v1(39.12,73.07) v1(39.12,71.93) v1(39.12,69.26) v1(39.12,67.99) v1(40.26,73.07) v1(40.25,71.93) v1(40.26,69.26) v1(40.27,67.99) v1(41.43,73.07) v1(41.42,71.93) v1(41.4,69.26) v1(41.43,67.99) v1(42.72,73.07) v1(42.72,71.93) v1(42.7,69.26) v1(42.71,67.99) v1(44.2,73.07) v1(44.21,71.93) v1(44.25,67.99) v1(44.26,69.26) v1(45.56,73.07) v1(45.57,71.93) v1(45.57,69.26) v1(45.57,67.99)
1A_1: length 110.5
  Top Layer w0.762: DIZUO1.2 83.82,41.7 80.01,45.51 80.01,55.42 73.15,62.28 31.24,62.28 29.08,64.44 29.08,84 26.56,86.52 U2.4
1A_2: length 70
  Top Layer w0.762: U3.4 55.13,86.52 55.88,85.77 55.88,74.09 60.58,69.39 75.5,69.39 86.11,58.78 86.11,54.53 86.74,53.9 GUANJIE1.2
1A_3: length 35.4
  Top Layer w0.762: U4.4 82.69,86.52 83.44,85.77 83.44,73.07 90.04,66.47 GUANJIE2.2
1B_1: length 111
  Top Layer w0.762: U2.3 29.35,89.06 31.75,86.66 31.75,66.13 33.07,64.82 73.15,64.82 81.53,56.44 81.53,46.66 83.95,44.24 98.3,44.24
1B_2: length 69.5
  Top Layer w0.762: U3.3 56.53,89.06 57.53,88.06 57.53,75.11 61.85,70.79 76.2,70.79 87.63,59.36 87.63,57.2 88.39,56.44 GUANJIE1.1
1B_3: length 36.1
  Top Layer w0.762: GUANJIE2.1 90.17,69.01 85.09,74.09 85.09,87.93 83.96,89.06 U4.3
2A_1: length 110.5
  Top Layer w0.762: U2.5 25.67,83.98 26.67,82.98 26.67,63.8 29.59,60.88 72.39,60.88 78.36,54.91 78.36,44.62 83.82,39.16 98.3,39.16
2A_2: length 70.1
  Top Layer w0.762: U3.5 53.74,83.98 54.1,83.61 54.1,73.2 59.31,67.99 74.8,67.99 84.58,58.21 84.58,52.5 85.72,51.36 GUANJIE1.3
2A_3: length 34.4
  Top Layer w0.762: U4.5 80.66,83.98 81.53,83.11 81.53,72.06 89.66,63.93 GUANJIE2.3
2B_1: length 118
  Top Layer w0.762: DIZUO1.4 83.82,36.62 76.71,43.74 76.71,54.15 71.5,59.36 24,59.36 19.05,64.31 19.05,80.44 20.05,81.44 U2.6
2B_2: length 72.7
  Top Layer w0.762: GUANJIE1.4 86.11,48.82 83.19,51.74 83.19,57.33 74.04,66.47 56.51,66.47 48.51,74.47 48.51,80.43 49.53,81.44 U3.6
2B_3: length 39.4
  Top Layer w0.762: U4.6 75.93,81.44 75.18,80.69 75.18,72.95 75.95,72.18 77.02,72.18 87.82,61.39 GUANJIE2.4
A4988_DIR: length 181.2
  Top Layer w0.254: v1(96.9,93.27) 96.03,94.14 U4.16 91.35,98.44 90.55,99.24 68.45,99.24 v1(66.8,97.58) 65.79,98.6 39.12,98.6 36.35,95.83 U2.16
  Bottom Layer w0.254: v1(96.9,93.27) 96.9,74.34 95.25,72.69 92.71,72.69 91.95,71.93 91.95,37.51 90.04,35.61 90.04,22.15 86.47,18.58 BOARD1.D15 ; v1(66.8,97.58) 66.93,97.46 66.93,94.79 66.28,94.14 U3.16
A4988_EN: length 175.5
  Top Layer w0.254: U4.9 89.17,76.36 88.65,76.88 88.65,98.22 88.26,98.6 69.6,98.6 68.83,97.84 v1(68.83,77.01)
  Bottom Layer w0.254: U4.9 91.35,38.44 89.27,36.36 BOARD1.D19 ; v1(68.83,77.01) 68.19,76.36 U3.9 63.85,73.3 61.34,70.79 38.1,70.79 36.35,72.54 U2.9
A4988_MS0: length 178.1
  Top Layer w0.254: BOARD1.D23 v1(74.15,49.06) ; U2.10 39.39,78.9 40.89,80.41 40.89,95.55 41.91,96.57 59.44,96.57 59.69,96.31 59.69,79.68 60.47,78.9 U3.10 ; v1(89.66,77.65) 89.66,78.28 90.28,78.9 U4.10
  Bottom Layer w0.254: v1(89.66,77.65) 89.66,51.48 87.24,49.06 v1(74.15,49.06) ; U3.10 66.91,78.9 71.37,83.36 71.37,96.06 72.14,96.82 87.76,96.82 88.39,96.19 88.39,79.93 89.42,78.9 U4.10
A4988_MS1: length 202.6
  Top Layer w0.254: U3.11 61.48,81.44 60.45,82.47 60.45,96.95 60.07,97.33 41.4,97.33 40,95.93 40,82.6 38.85,81.44 U2.11 ; v1(33.02,63.29) 30.61,65.71 30.61,85.52 v1(29.46,86.66)
  Bottom Layer w0.254: U2.11 34.43,81.44 33.27,82.6 33.27,88.95 32.38,89.84 29.72,89.84 29.46,89.58 v1(29.46,86.66) ; BOARD1.D12 32.14,21.12 31.37,21.89 31.37,61.64 v1(33.02,63.29) ; U3.11 68.31,81.44 70.74,83.87 70.74,96.7 71.5,97.46 88.14,97.46 89.28,96.31 89.28,82.09 89.93,81.44 U4.11
A4988_MS2: length 216.2
  Top Layer w0.254: U2.12 38.97,83.98 39.24,84.25 39.24,96.31 40.89,97.97 64.39,97.97 66.55,95.81 66.55,84.76 65.79,84 63.86,84 U3.12 ; v1(25.65,87.68) 26.92,87.68 29.97,84.63 29.97,65.07 v1(31.75,63.29)
  Bottom Layer w0.254: U3.12 69.72,83.98 69.98,84.23 69.98,97.08 70.87,97.97 94.36,97.97 95.63,96.7 95.63,84.88 94.73,83.98 U4.12 ; U2.12 34.69,83.98 34.29,84.38 34.29,88.69 32.51,90.47 26.29,90.47 25.65,89.84 v1(25.65,87.68) ; BOARD1.D13 31.51,18.58 30.61,19.48 30.61,62.15 v1(31.75,63.29)
A4988_STEP_1: length 90.3
  Top Layer w0.254: U2.15 33.9,91.6 32.89,90.6 32.89,67.74 34.29,66.34 v1(39.24,66.34)
  Bottom Layer w0.254: BOARD1.D21 66.28,38.9 67.44,40.05 67.44,57.2 62.61,62.02 41.91,62.02 39.24,64.69 v1(39.24,66.34)
A4988_STEP_2: length 140.6
  Top Layer w0.254: BOARD1.D14 20.59,23.66 18.42,25.83 18.42,61.01 17.14,62.28 17.14,95.17 v1(19.05,97.08)
  Bottom Layer w0.254: U3.15 62.62,91.6 61.98,92.25 61.98,96.57 61.47,97.08 v1(19.05,97.08)
A4988_STEP_3: length 249.1
  Top Layer w0.254: v1(67.82,85.39) 67.82,75.87 68.45,75.23 70.49,75.23 70.87,75.61 70.87,96.19 72.01,97.33 86.61,97.33 87.76,96.19 87.76,75.11 88.52,74.34 93.98,74.34 94.49,74.85 94.49,91.23 94.12,91.6 U4.15 ; BOARD1.D27 20.84,26.2 19.05,27.99 19.05,61.26 17.78,62.53 17.78,94.03 23.11,99.36 66.42,99.36 v1(66.8,98.98)
  Bottom Layer w0.254: v1(67.82,85.39) 67.82,97.97 v1(66.8,98.98)
RX1: length 43.7
  Top Layer w0.254: UADT1.3 89.03,24.94 72.53,41.44 BOARD1.RX0
RX2: length 42.5
  Top Layer w0.254: UART2.3 87,12.62 73.42,26.2 BOARD1.RX2
TX1: length 43.7
  Top Layer w0.254: UADT1.2 89.28,27.48 72.78,43.98 BOARD1.TX0
TX2: length 42.5
  Top Layer w0.254: BOARD1.TX2 72.91,28.74 86.49,15.16 UART2.2
ULN2003_A_1: length 85.5
  Top Layer w0.508: BOARD1.D2 59.04,21.12 56.13,18.21 56.13,5.13 52.83,1.83 10.54,1.83 3.43,8.94 uln2003.1
ULN2003_A_2: length 88.6
  Top Layer w0.508: 3.43,20.37 5.46,20.37 5.97,19.86 5.97,8.3 11.18,3.1 52.07,3.1 54.48,5.51 54.48,19.48 58.66,23.66 BOARD1.D4
ULN2003_A_3: length 96.8
  Top Layer w0.508: BOARD1.D5 56.88,31.28 53.09,27.48 53.09,6.02 51.56,4.49 12.06,4.49 8.25,8.3 8.25,21.13 6.48,22.91 3.43,22.91
ULN2003_A_4: length 97.9
  Top Layer w0.508: uln2003.4 6.86,25.45 10.03,22.27 10.03,8.68 12.83,5.89 50.55,5.89 51.82,7.16 51.82,28.12 57.52,33.82 BOARD1.D18
$1N825: length 2.5
  Top Layer w0.254: U2.14 U2.13
$1N826: length 2.5
  Top Layer w0.254: U3.13 U3.14
$1N849: length 2.5
  Top Layer w0.254: U4.13 U4.14

## Copper pours and planes (outline as drawn; the poured copper is in the pictures)
+5V on Top Layer: 0.64,50.47 1.78,51.61 6.86,51.61 8.38,50.09 8.38,27.99 7.11,26.72 1.78,26.72 0.64,27.86
GND on Top Layer: 0,100.25 100,100.25 100,0.25 0,0.25
GND on Bottom Layer: 0,100.25 100,100.25 100,0.25 0,0.25
VBAT_IN on Top Layer: 37.34,73.2 37.85,73.71 46.35,73.71 46.86,73.2 46.86,67.61 46.35,67.1 37.85,67.1 37.34,67.61
VBAT_IN on Top Layer: 20.19,75.74 21.97,77.52 25.27,77.52 25.78,77.01 25.78,72.06 25.65,71.93 21.34,71.93 20.19,73.07
VBAT_IN on Bottom Layer: 0.89,74.6 1.65,75.36 19.43,75.36 21.59,77.52 30.35,77.52 33.78,74.09 44.7,74.09 48.26,77.65 59.69,77.65 61.21,76.12 61.21,74.23 63,72.45 73.34,72.45 75.18,74.29 75.18,76.25 76.58,77.65 81.79,77.65 83.28,76.16 83.28,65.38 80.35,62.45 19.35,62.45 15.75,58.85 2.67,58.85 0.89,60.63
$1N1306 on Top Layer: 0.76,98.22 1.65,99.11 14.1,99.11 15.11,98.09 15.11,76.5 13.46,74.85 2.03,74.85 0.76,76.12

# Board PCB1
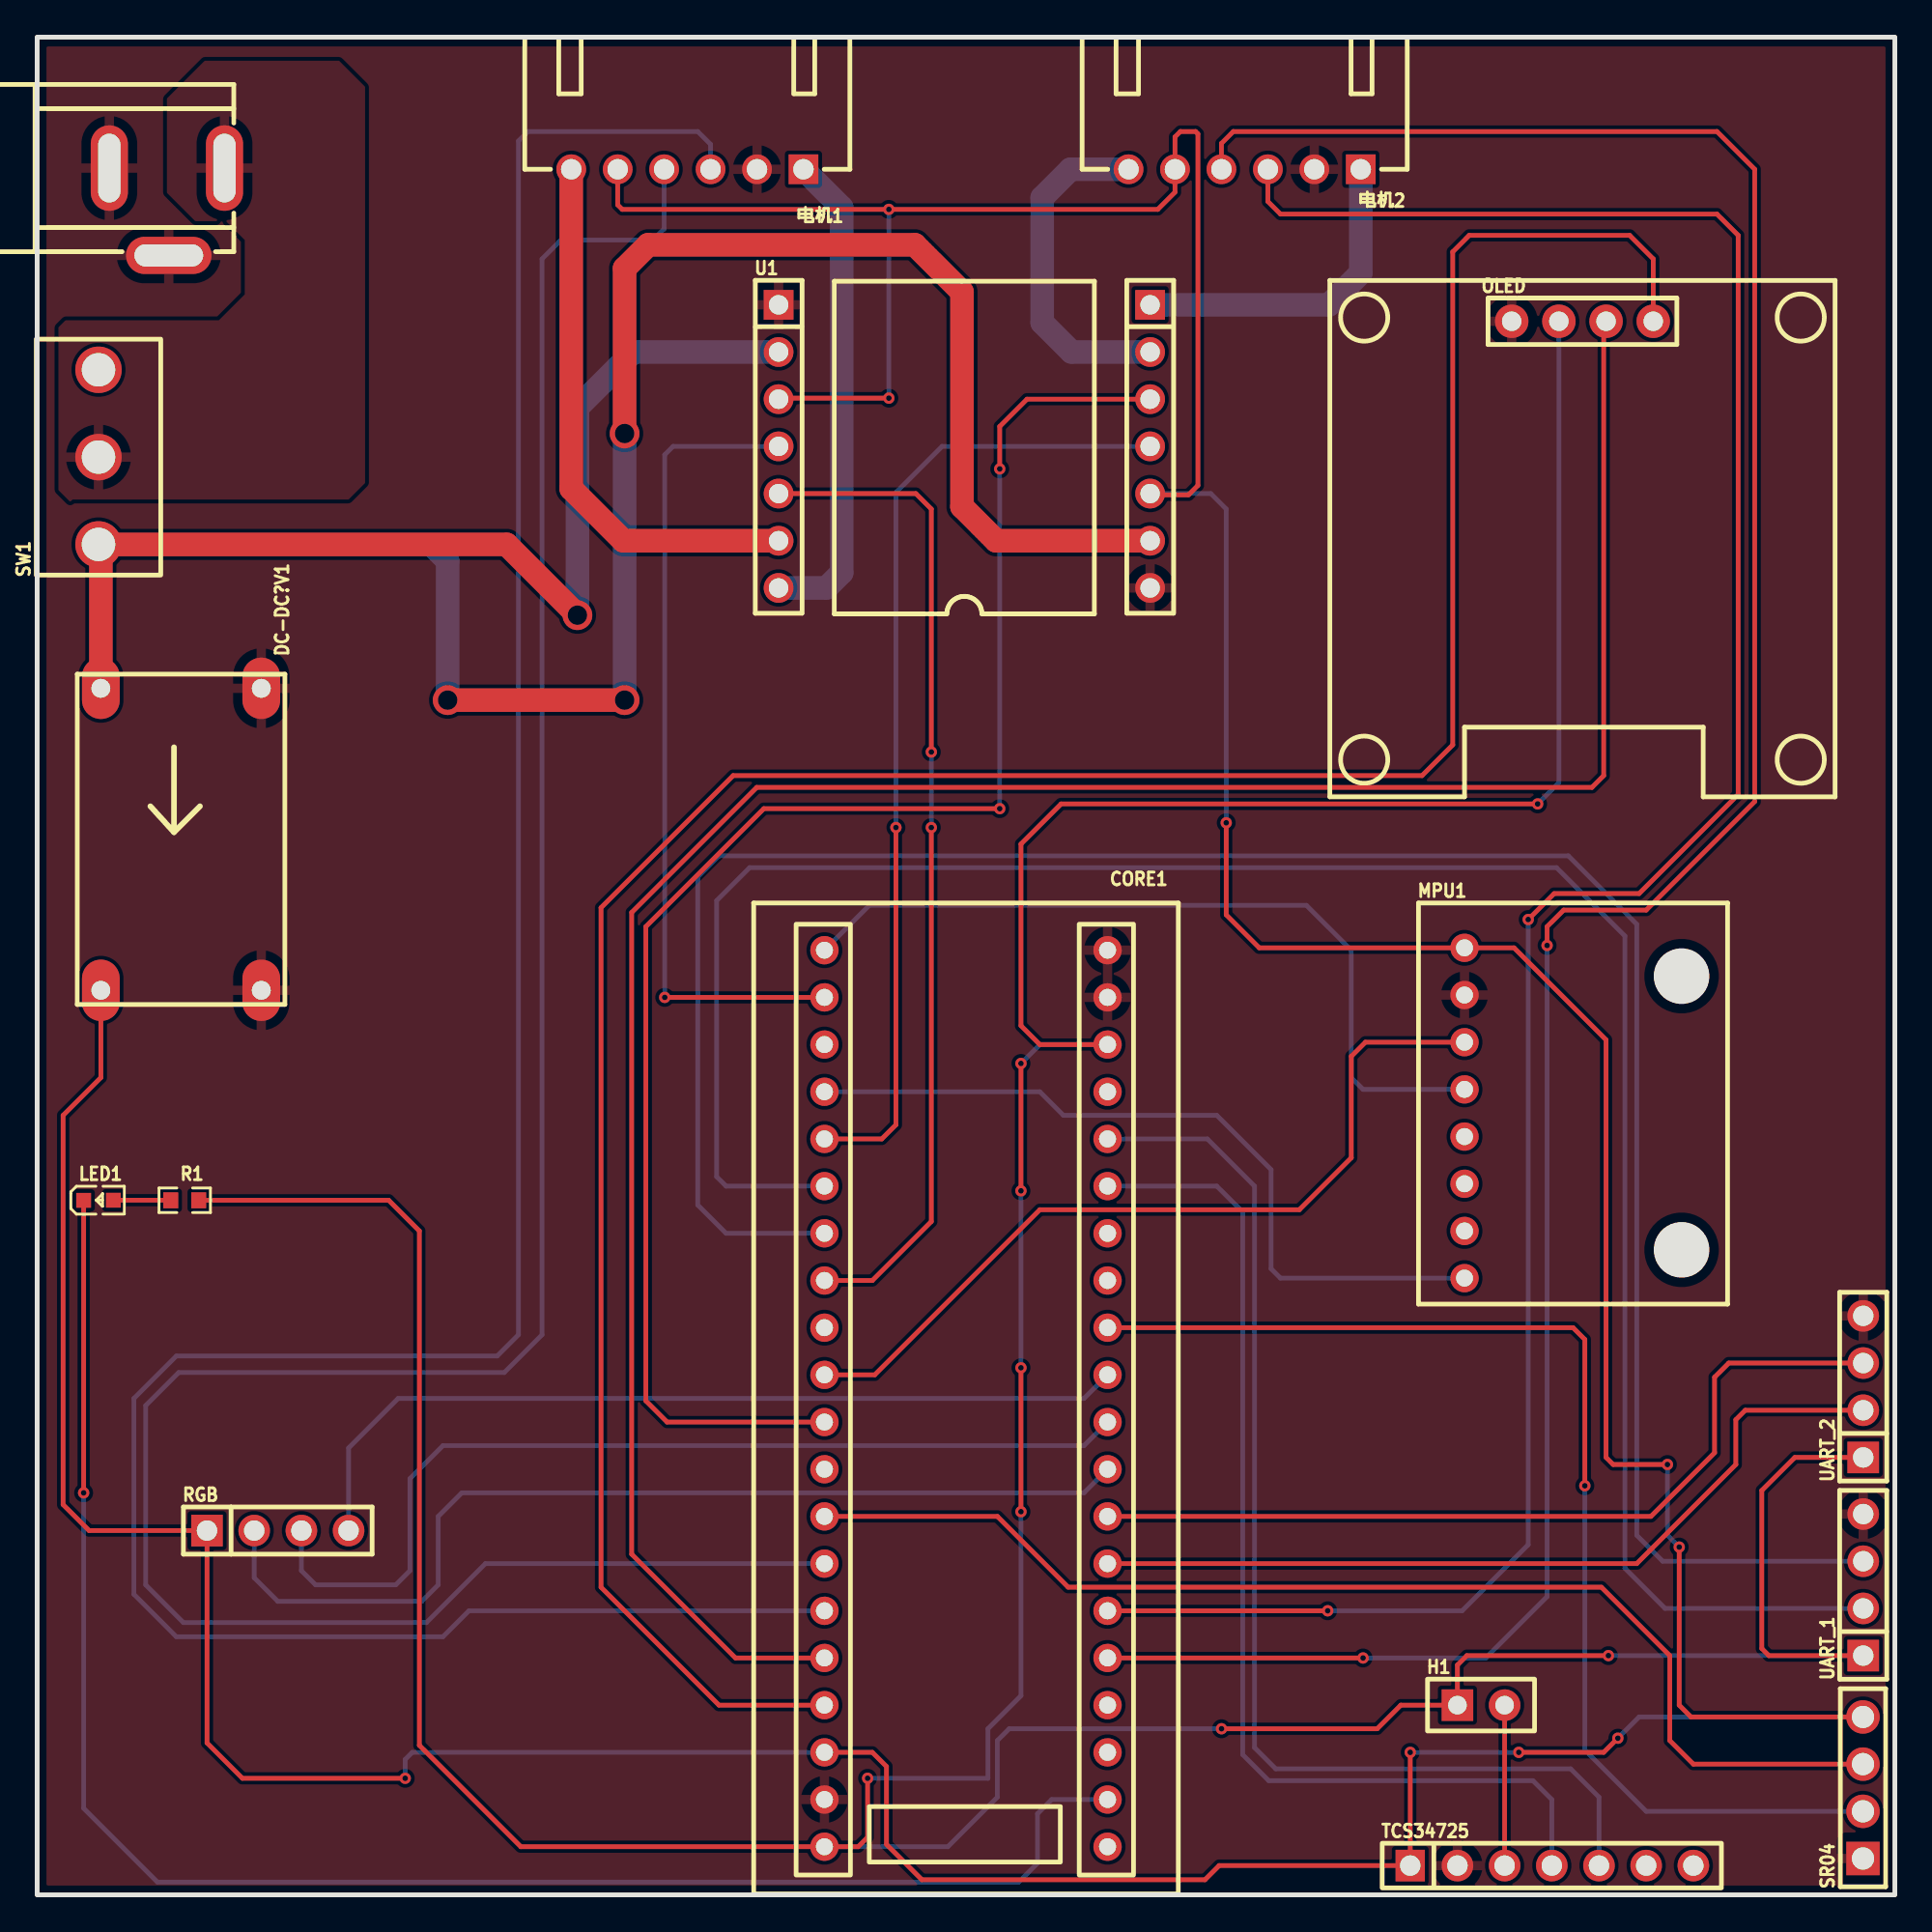
[diagram p4: board, top side]
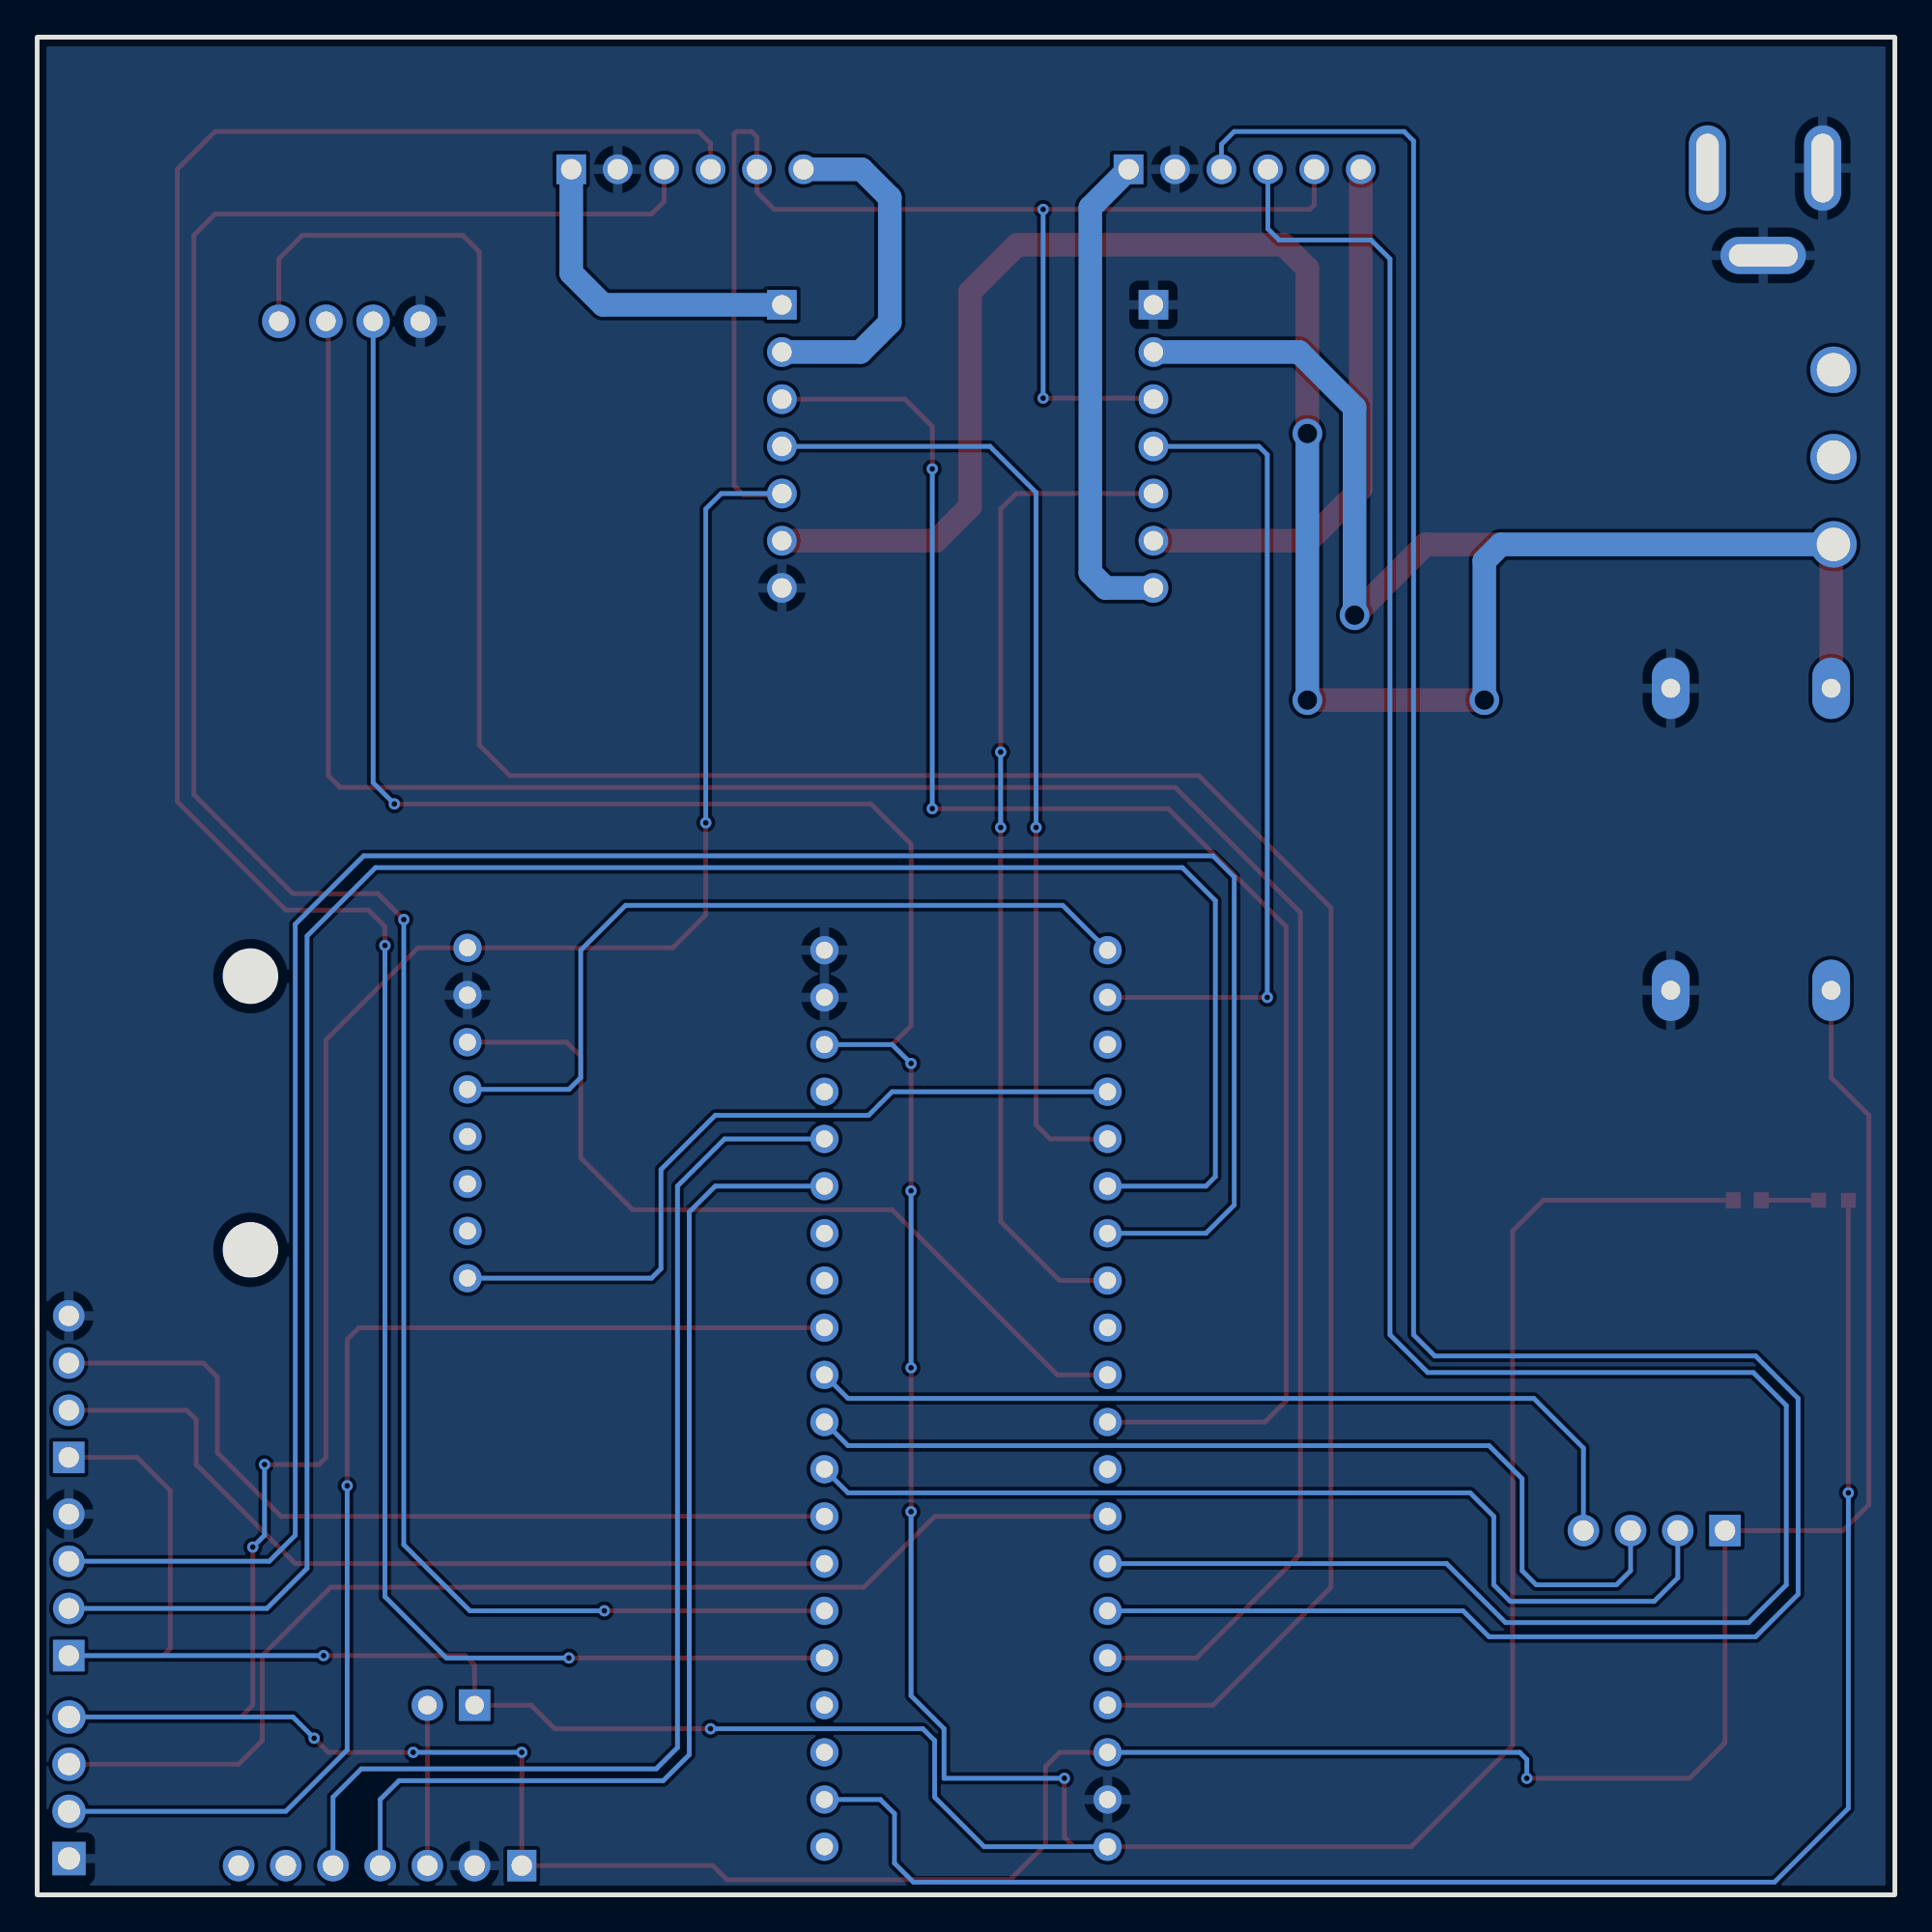
[diagram p5: board, bottom side, seen from below]

Outline 100 x 100 mm; copper layers: Top Layer, Bottom Layer. Coordinates in mm from the lower left corner of the outline.
Outline path: rectangle 0,100 100,0
Stack: Top Layer 0.035mm / Dielectric1 1.51mm FR4 er 4.5 / Bottom Layer 0.035mm

## Design rules (mm)
template: JLCPCB Capability(Two Layers Board)
spacing copperThickness1oz (default): track to track 0.102, other pairs 0.152 to 0.3
spacing copperThickness2oz: track to track 0.203, other pairs 0.152 to 0.3
track width copperThickness1oz (default): min 0.127, default 0.254, max 2.54
track width copperThickness2oz: min 0.203, default 0.254, max 2.54
differential pair differentialPair (default): width min 0.127, default 0.254, max 2.54; gap min 0.152, default 0.152
via viaSize (default): diameter min 0.5, default 0.61, max 10; hole min 0.3, default 0.305, max 6.3

## Placement (name value [footprint] x y rotation side)
CORE1  -  [STM32F103C8T6核心板]  50 26.72 180 top
DC1  DC005  [DC-IN-TH_DC005]  6.98 90.6 0 top
DC-DC?V1  -  [DC-DC迷你降压模块]  2.16 64.95 270 top
H1  -  [HDR-TH_2P-P2.54-V-F]  77.72 10.21 0 top
LED1  NCD0603R1  [LED0603-RD_RED]  3.3 37.39 0 top
MPU1  MPU6050 有孔(锁定丝印)  [MPU6050-丝印不可移]  76.84 50.98 0 top
OLED  HS96L03W2C03  [OLED-TH_L27.8-W27.2-P2.54_C9900033791]  83.19 84.71 0 top
R1  4.7kΩ  [R0603]  7.94 37.39 180 top
RGB  RGB  [HDR-TH_4P-P2.54-V-M]  12.95 19.61 0 top
SR04  A2541HWV-4P  [HDR-TH_4P-P2.54-V_A2541HWV-4P]  98.29 5.77 90 top
SW1  SS-12D10L5  [SW-TH_SS-12D10L5]  3.3 77.39 90 top
TCS34725  TCS34725  [HDR-TH_7P-P2.54-V-F]  81.53 1.57 0 top
U1  A4950模块  [A4950]  49.91 77.97 0 top
UART_1  UART_1  [HDR-TH_4P-P2.54-V-M]  98.3 16.69 90 top
UART_2  UART_2  [HDR-TH_4P-P2.54-V-M]  98.3 27.36 90 top
电机1  X8821WR-06S-N0SN  [CONN-TH_6P-P2.50_X8821WR-06S-N2SN]  35 92.89 180 top
电机2  X8821WR-06S-N0SN  [CONN-TH_6P-P2.50_X8821WR-06S-N2SN]  65 92.89 180 top

## Footprints (pads in the part's own frame, mm; a bottom-side part is the same pattern mirrored in y, then rotated)
A4950
  rect 1.6x1.6 hole 1.05: 1(-10,7.62) 14(10,7.62)
  round 1.6 hole 1.05: 2(-10,5.08) 3(-10,2.54) 4(-10,0) 5(-10,-2.54) 6(-10,-5.08) 7(-10,-7.62) 8(10,-7.62) 9(10,-5.08) 10(10,-2.54) 11(10,0) 12(10,2.54) 13(10,5.08)
CONN-TH_6P-P2.50_X8821WR-06S-N2SN
  rect 1.6x1.6 hole 1.1: 1(-6.25,0)
  round 1.6 hole 1.1: 2(-3.75,0) 3(-1.25,0) 4(1.25,0) 5(3.75,0) 6(6.25,0)
DC-DC迷你降压模块
  oval 3.302x2.032 hole 1.016: IN+(0,1.27) IN-(0,9.906) OUT+(16.256,1.27) OUT-(16.256,9.906)
DC-IN-TH_DC005
  oval 2x4.6 hole 1.2x3.7: 1(3.1,2.35) 2(-3.1,2.35)
  oval 4.6x2 hole 3.7x1.2: 3(0.1,-2.35)
HDR-TH_2P-P2.54-V-F
  rect 1.7x1.7 hole 1: 1(-1.27,0)
  round 1.7 hole 1: 2(1.27,0)
HDR-TH_4P-P2.54-V-M
  rect 1.7x1.7 hole 1.1: 1(-3.81,0)
  round 1.7 hole 1.1: 2(-1.27,0) 3(1.27,0) 4(3.81,0)
HDR-TH_4P-P2.54-V_A2541HWV-4P
  rect 1.8x1.8 hole 1.2: 1(-3.81,0)
  round 1.8 hole 1.2: 2(-1.27,0) 3(1.27,0) 4(3.81,0)
HDR-TH_7P-P2.54-V-F
  rect 1.575x1.7 hole 1.1: 1(-7.62,0)
  round 1.7 hole 1.1: 2(-5.08,0) 3(-2.54,0) 4(0,0) 5(2.54,0) 6(5.08,0) 7(7.62,0)
LED0603-RD_RED
  rect 0.8x0.8 smd: 1(-0.799,-0.004) 2(0.799,0.004)
MPU6050-丝印不可移
  round 1.524 hole 0.914: 1(0,0) 2(0,-2.54) 3(0,-5.08) 4(0,-7.62) 5(0,-10.16) 6(0,-12.7) 7(0,-15.24) 8(0,-17.78)
OLED-TH_L27.8-W27.2-P2.54_C9900033791
  round 1.8 hole 1.05: 1(-3.81,0) 2(-1.27,0) 3(1.27,0) 4(3.81,0)
R0603
  rect 0.806x0.864 smd: 1(-0.753,0) 2(0.753,0)
STM32F103C8T6核心板
  round 1.524 hole 0.914: 1(-7.62,24.13) 2(-7.62,21.59) 3(-7.62,19.05) 4(-7.62,16.51) 5(-7.62,13.97) 6(-7.62,11.43) 7(-7.62,8.89) 8(-7.62,6.35) 9(-7.62,3.81) 10(-7.62,1.27) 11(-7.62,-1.27) 12(-7.62,-3.81) 13(-7.62,-6.35) 14(-7.62,-8.89) 15(-7.62,-11.43) 16(-7.62,-13.97) 17(-7.62,-16.51) 18(-7.62,-19.05) 19(-7.62,-21.59) 20(-7.62,-24.13) 21(7.62,-24.13) 22(7.62,-21.59) 23(7.62,-19.05) 24(7.62,-16.51) 25(7.62,-13.97) 26(7.62,-11.43) 27(7.62,-8.89) 28(7.62,-6.35) 29(7.62,-3.81) 30(7.62,-1.27) 31(7.62,1.27) 32(7.62,3.81) 33(7.62,6.35) 34(7.62,8.89) 35(7.62,11.43) 36(7.62,13.97) 37(7.62,16.51) 38(7.62,19.05) 39(7.62,21.59) 40(7.62,24.13)
SW-TH_SS-12D10L5
  round 2.5 hole 1.8: 1(-4.7,0) 2(0,0) 3(4.7,0)

## Nets
As in the schematic.

Pads without a net: CORE1 1 3 4 13 14 17 23 29 32; MPU1 5 6 7; SW1 3; TCS34725 6 7

## Via types
v1: diameter 0.61, hole 0.305, Top Layer to Bottom Layer, 29 vias
v2: diameter 1.6, hole 1.049, Top Layer to Bottom Layer, 4 vias

## Routing (per net, layer and track width the routed paths; a pad name or vN(x,y) marks a point on that pad's centre or on a via; arc(x,y) is an arc through that point)
3V3: length 274.4
  Top Layer w0.254: v1(52.96,28.37) v1(52.96,20.62) ; v1(52.96,44.75) v1(52.96,37.9) ; CORE1.18 53.97,45.77 52.96,46.79 52.96,56.57 55.12,58.72 v1(80.77,58.72) ; UART_2.1 94.62,23.55 92.84,21.77 92.84,13.26 93.22,12.88 UART_1.1 ; v1(63.75,8.94) 72.14,8.94 73.41,10.21 H1.1 76.45,12.37 76.96,12.88 v1(84.58,12.88) ; 8.7,37.39 18.92,37.39 20.57,35.74 20.57,8.05 26.03,2.59 CORE1.40 44.2,2.59 44.7,3.1 v1(44.7,6.27)
  Bottom Layer w0.254: v1(52.96,20.62) 52.96,10.72 51.18,8.94 51.18,6.27 v1(44.7,6.27) ; v1(63.75,8.94) 52.32,8.94 51.69,8.31 51.69,5.26 49.02,2.59 CORE1.40 ; UART_1.1 v1(84.58,12.88) ; v1(52.96,37.9) v1(52.96,28.37) ; OLED.2 81.91,59.87 v1(80.77,58.72) ; v1(52.96,44.75) 53.97,45.77 CORE1.18
5V: length 325.4
  Top Layer w0.254: CORE1.38 44.96,7.67 45.72,6.91 45.72,2.72 47.62,0.81 62.87,0.81 63.63,1.57 TCS34725.1 v1(73.91,7.67) ; v1(64.01,57.71) 64.01,52.76 65.79,50.98 MPU1.1 79.5,50.98 84.46,46.03 84.46,23.55 84.84,23.16 v1(87.76,23.16) ; v1(79.76,7.67) 84.33,7.67 v1(85.09,8.43) ; DC-DC?V1.OUT+ 3.43,43.99 1.4,41.96 1.4,21.01 2.79,19.61 RGB.1 9.14,8.18 11.05,6.27 v1(19.81,6.27) ; 电机1.5 31.25,90.97 31.5,90.73 v1(45.85,90.73) 60.32,90.73 61.25,91.65 电机2.5 61.25,94.63 61.54,94.92 62.36,94.92 62.48,94.79 62.48,75.87 61.98,75.36 59.98,75.36 U1.10 ; v1(45.85,80.57) 39.97,80.57 U1.3 ; SR04.4 89.03,9.58 88.39,10.21 v1(88.39,18.72)
  Bottom Layer w0.254: U1.10 63.18,75.43 64.01,74.6 v1(64.01,57.71) ; CORE1.38 20.19,7.67 19.81,7.29 v1(19.81,6.27) ; v1(45.85,90.73) v1(45.85,80.57) ; v1(88.39,18.72) 87.76,19.35 v1(87.76,23.16) ; v1(73.91,7.67) v1(79.76,7.67) ; v1(85.09,8.43) 86.23,9.58 SR04.4
VBAT_IN: length 160
  Top Layer w1.27: v2(29.08,68.89) 25.27,72.69 SW1.1 3.43,72.57 DC-DC?V1.IN+ ; v2(22.1,64.31) v2(31.62,64.31) ; U1.9 51.62,72.89 49.78,74.73 49.78,86.28 47.24,88.82 32.89,88.82 31.62,87.55 v2(31.62,78.66)
  Bottom Layer w1.27: v2(29.08,68.89) 29.08,80.06 32.07,83.05 U1.2 ; v2(22.1,64.31) 22.1,71.81 21.21,72.69 SW1.1 ; v2(31.62,64.31) v2(31.62,78.66)
6050_INT: length 41.7
  Bottom Layer w0.254: MPU1.8 66.93,33.2 66.42,33.71 66.42,39.04 63.5,41.96 55.25,41.96 53.97,43.23 CORE1.24
6050_SCL: length 45.1
  Top Layer w0.254: MPU1.3 71.5,45.9 70.74,45.14 70.74,39.67 67.94,36.88 53.97,36.88 45.09,27.99 CORE1.30
6050_SDA: length 43.6
  Bottom Layer w0.254: CORE1.21 44.79,53.26 68.33,53.26 70.74,50.85 70.74,43.99 71.37,43.36 MPU1.4
AIN1: length 44.1
  Top Layer w0.254: CORE1.22 v1(33.78,48.31)
  Bottom Layer w0.254: v1(33.78,48.31) 33.78,77.52 34.23,77.97 U1.4
AO1: length 18.5
  Bottom Layer w1.27: 电机2.6 55.63,92.89 54.1,91.36 54.1,84.63 55.68,83.05 U1.13
AO2: length 17.6
  Bottom Layer w1.27: 电机2.1 71.25,87.3 69.54,85.59 U1.14
AO_A: length 140.3
  Top Layer w0.254: 电机2.4 63.75,94.28 64.39,94.92 90.42,94.92 92.46,92.89 92.46,58.85 86.61,53.01 82.17,53.01 81.28,52.12 v1(81.28,51.11) ; CORE1.5 v1(71.37,12.75)
  Bottom Layer w0.254: v1(71.37,12.75) 77.98,12.75 81.28,16.05 v1(81.28,51.11)
AO_B: length 129.8
  Top Layer w0.254: CORE1.6 v1(69.47,15.29) ; v1(80.26,52.5) 81.66,53.9 86.23,53.9 91.57,59.23 91.57,89.33 90.42,90.47 66.93,90.47 66.25,91.15 电机2.3
  Bottom Layer w0.254: v1(69.47,15.29) 76.71,15.29 80.26,18.85 v1(80.26,52.5)
BIN1: length 86.6
  Top Layer w0.254: U1.12 53.28,80.51 51.82,79.05 v1(51.82,76.76) ; CORE1.31 33.91,25.45 32.77,26.59 32.77,52.12 39.12,58.47 v1(51.82,58.47)
  Bottom Layer w0.254: v1(51.82,58.47) v1(51.82,76.76)
BO1: length 29.5
  Top Layer w1.27: 电机1.6 28.75,75.69 31.55,72.89 U1.6
BO2: length 26.3
  Bottom Layer w1.27: 电机1.1 43.31,90.83 43.31,71.17 42.49,70.35 U1.7
BO_A: length 139.6
  Bottom Layer w0.254: CORE1.34 24.13,17.83 20.95,14.66 7.87,14.66 5.84,16.69 5.84,26.34 7.62,28.12 25.15,28.12 27.18,30.15 27.18,88.06 28.19,89.08 33.15,89.08 33.75,89.68 电机1.4
BO_B: length 147.8
  Bottom Layer w0.254: 电机1.3 36.25,94.23 35.56,94.92 26.42,94.92 25.91,94.41 25.91,30.15 24.77,29.01 7.49,29.01 5.21,26.72 5.21,16.18 7.49,13.89 21.84,13.89 23.24,15.29 CORE1.35
IIC2_SCL: length 58.3
  Bottom Layer w0.254: CORE1.15 63.5,38.15 64.9,36.75 64.9,7.54 66.29,6.15 80.52,6.15 81.53,5.13 TCS34725.4
IIC2_SDA: length 62.5
  Bottom Layer w0.254: TCS34725.5 84.07,5.26 82.55,6.78 66.68,6.78 65.53,7.93 65.53,38.15 62.99,40.69 CORE1.16
LED: length 92.9
  Top Layer w0.254: LED1.1 v1(2.5,21.64)
  Bottom Layer w0.254: v1(2.5,21.64) 2.5,4.66 6.48,0.69 52.83,0.69 53.85,1.7 53.85,4.37 54.61,5.13 CORE1.2
OLED_SCL: length 127.1
  Top Layer w0.254: CORE1.36 37.59,12.75 32,18.34 32,52.88 38.74,59.61 83.69,59.61 84.33,60.25 84.33,84.58 OLED.3
OLED_SDA: length 142.3
  Top Layer w0.254: OLED.4 87,88.06 85.72,89.33 77.09,89.33 76.2,88.44 76.2,61.9 74.55,60.25 37.47,60.25 30.35,53.14 30.35,16.56 36.7,10.21 CORE1.37
PWMA: length 54
  Top Layer w0.254: CORE1.28 44.96,33.07 48.13,36.25 v1(48.13,57.45) ; v1(48.13,61.52) 48.13,74.6 47.3,75.43 U1.5
  Bottom Layer w0.254: v1(48.13,57.45) v1(48.13,61.52)
PWMB: length 52.9
  Top Layer w0.254: CORE1.25 45.47,40.69 46.23,41.45 v1(46.23,57.45)
  Bottom Layer w0.254: v1(46.23,57.45) 46.23,75.49 48.71,77.97 U1.11
RGB_B: length 46.9
  Bottom Layer w0.254: CORE1.11 56.35,26.72 19.43,26.72 16.76,24.05 RGB.4
RGB_G: length 52.4
  Bottom Layer w0.254: RGB.3 14.22,17.45 14.99,16.69 19.3,16.69 20.07,17.45 20.07,22.4 21.84,24.18 56.35,24.18 CORE1.10
RGB_R: length 54.1
  Bottom Layer w0.254: RGB.2 11.68,17.07 12.95,15.8 20.7,15.8 21.59,16.69 21.59,20.37 22.86,21.64 56.35,21.64 CORE1.9
SR04_ECHO: length 64.4
  Top Layer w0.254: v1(83.31,22.02) 83.31,29.9 82.68,30.53 CORE1.12
  Bottom Layer w0.254: v1(83.31,22.02) 83.31,7.8 86.61,4.5 SR04.2
SR04_TRIG: length 64.1
  Top Layer w0.254: CORE1.33 51.69,20.37 55.5,16.56 84.2,16.56 87.88,12.88 87.88,8.31 89.15,7.04 SR04.3
USART1_RX: length 123.3
  Bottom Layer w0.254: CORE1.27 37.08,35.61 35.56,37.14 35.56,54.79 36.7,55.93 82.42,55.93 86.11,52.25 86.11,19.35 87.5,17.96 UART_1.3
USART1_TX: length 119.8
  Bottom Layer w0.254: UART_1.2 87.63,15.42 85.47,17.58 85.47,51.61 81.79,55.3 38.35,55.3 36.58,53.52 36.58,38.66 37.08,38.15 CORE1.26
USART2_RX: length 46.5
  Top Layer w0.254: CORE1.8 86.87,20.37 90.3,23.8 90.3,27.86 91.06,28.63 UART_2.3
USART2_TX: length 45.5
  Top Layer w0.254: CORE1.7 86.11,17.83 91.44,23.16 91.44,25.58 91.95,26.09 UART_2.2
$1N1648: length 8.6
  Top Layer w0.254: TCS34725.3 H1.2
$1N3009: length 3.1
  Top Layer w0.254: LED1.2 7.19,37.39 R1.2

## Copper pours and planes (outline as drawn; the poured copper is in the pictures)
GND on Top Layer: 0,100 100,100 100,0 0,0
GND on Bottom Layer: 0,100 100,100 100,0 0,0
$1N1070 on Top Layer: 6.98,96.7 9.02,98.73 16.26,98.73 17.65,97.33 17.65,76 16.76,75.11 1.91,75.11 1.78,74.98 1.14,75.62 1.14,84.38 1.52,84.76 9.78,84.76 11.18,86.16 11.18,89.08 10.16,90.09 8.51,90.09 6.98,91.62
